# EAGLE design BabyMainBoard_Samd51_SPI_2.3.1_fram_pro_jun2022 (EAGLE 9.6.2)
VVERSION: v1.5 Jan 2022

## Sheet 1 of 3
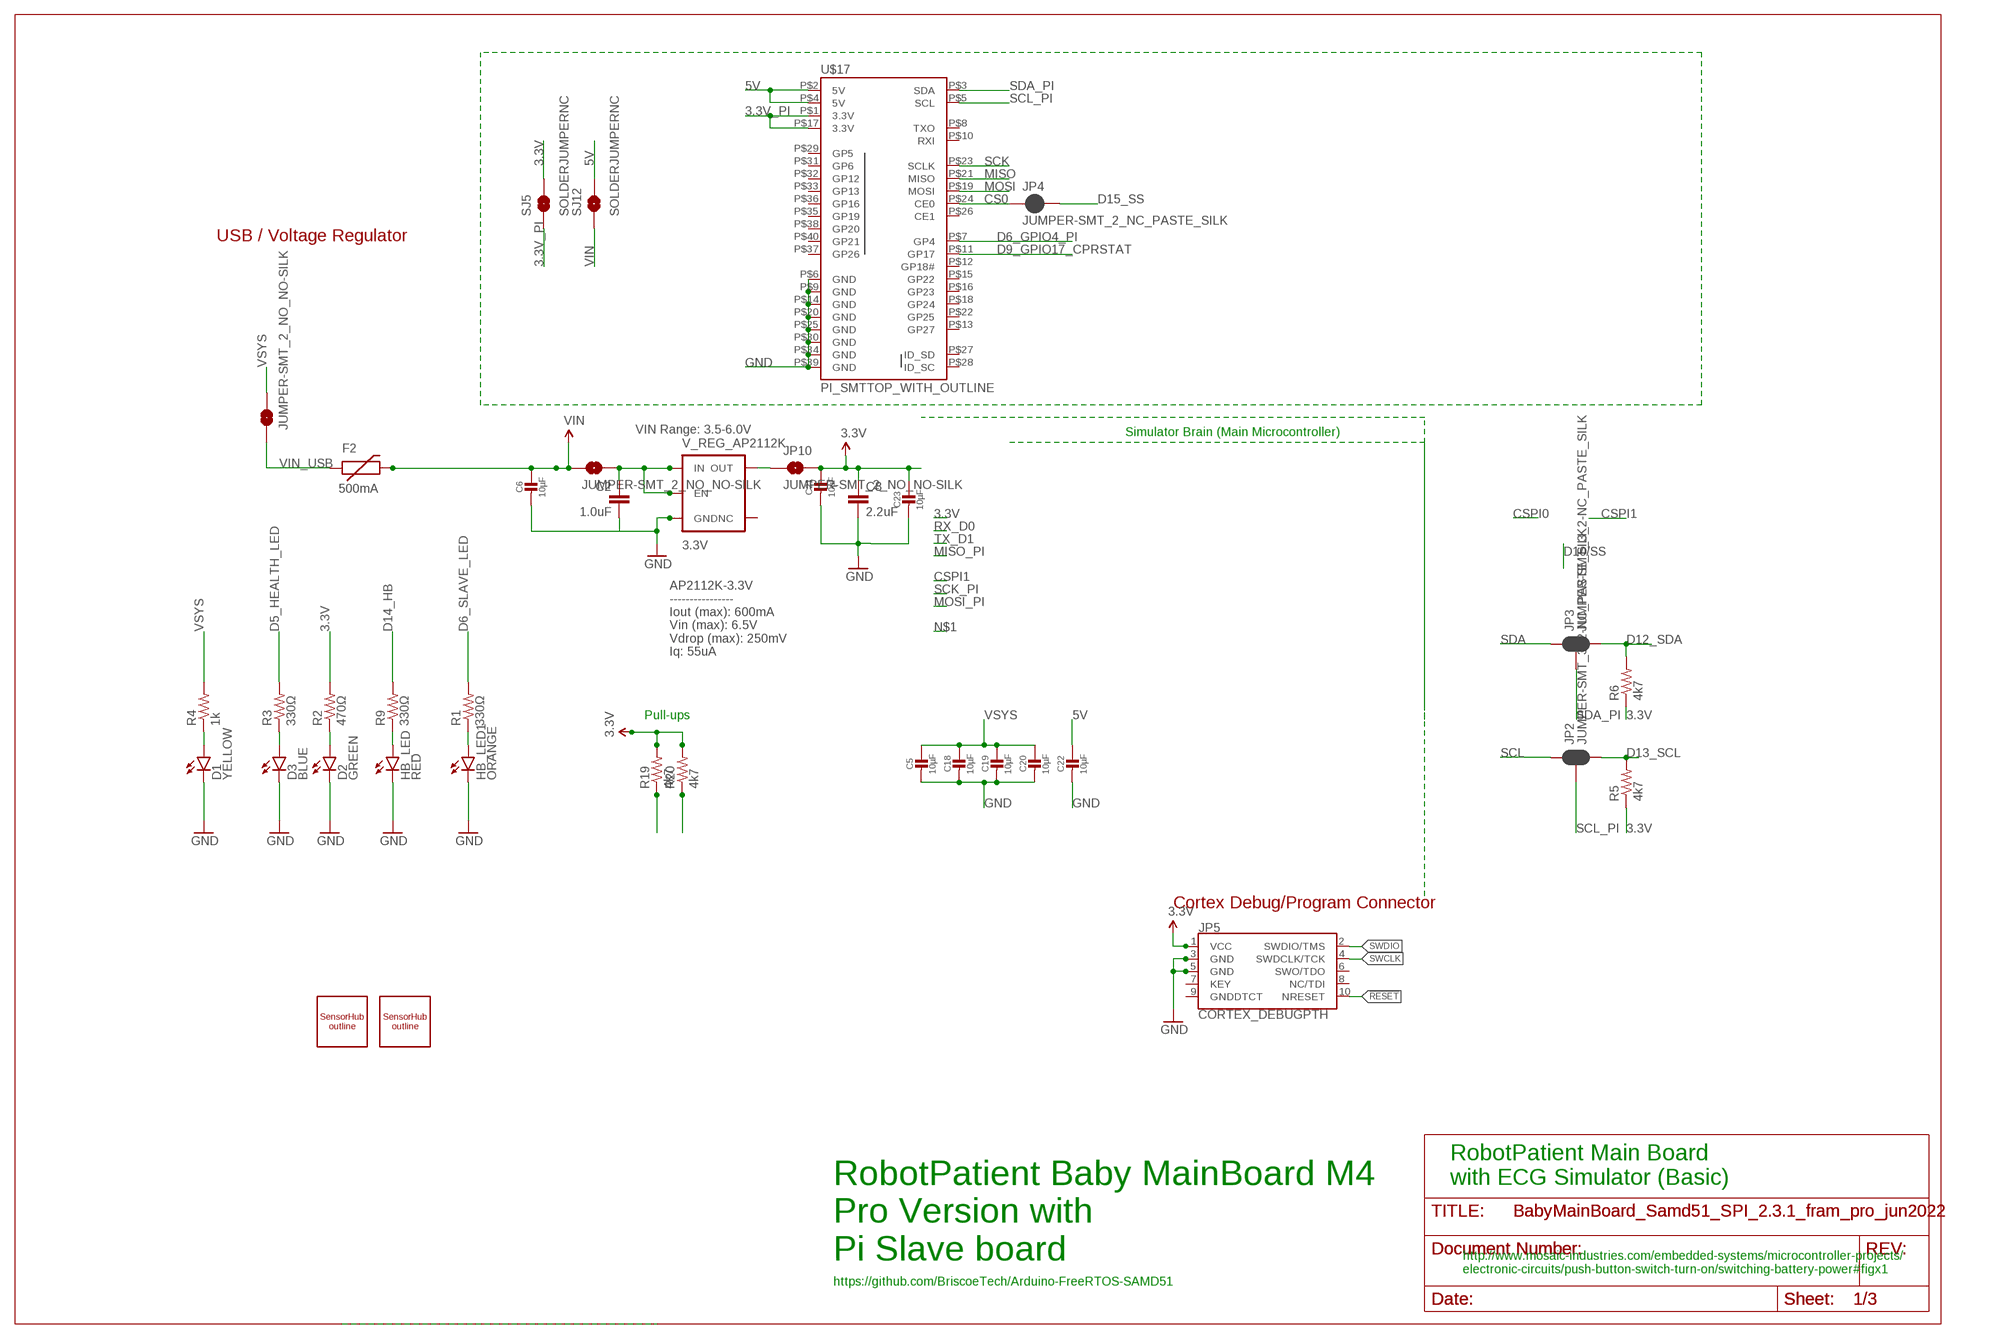
[diagram p0: schematic, sheet 1]

### Parts
C2  1.0uF  1.0UF-25V-+80/-20(0805)"  [0805-CAP]
C5  10µF  CAP_CERAMIC0805  [0805]
C6  10µF  CAP_CERAMIC0805  [0805]
C8  2.2uF  2.2UF-10V-20%(0603)  [0603-CAP]
C18  10µF  CAP_CERAMIC0805  [0805]
C19  10µF  CAP_CERAMIC0805  [0805]
C20  10µF  CAP_CERAMIC0805  [0805]
C21  10µF  CAP_CERAMIC0805  [0805]
C22  10µF  CAP_CERAMIC0805  [0805]
C23  10µF  CAP_CERAMIC0805  [0805]
D1  YELLOW  LED-RED0603  [LED-0603]
D2  GREEN  LED-RED0603  [LED-0603]
D3  BLUE  LED-BLUE0603  [LED-0603]
F2  500mA  PTCSMD  [PTC-1206]
HB_LED  RED  LED-RED0603  [LED-0603]
HB_LED1  ORANGE  LED-RED0603  [LED-0603]
JP1  JUMPER-SMT_2_NO_NO-SILK  [SMT-JUMPER_2_NO_NO-SILK]
JP2  JUMPER-SMT_3_2-NC_PASTE_SILK  [SMT-JUMPER_3_2-NC_PASTE_SILK]
JP3  JUMPER-SMT_3_2-NC_PASTE_SILK  [SMT-JUMPER_3_2-NC_PASTE_SILK]
JP4  JUMPER-SMT_2_NC_PASTE_SILK  [SMT-JUMPER_2_NC_PASTE_SILK]
JP5  CORTEX_DEBUGPTH  [2X5-PTH-1.27MM]
JP10  JUMPER-SMT_2_NO_NO-SILK  [SMT-JUMPER_2_NO_NO-SILK]
JP11  JUMPER-SMT_2_NO_NO-SILK  [SMT-JUMPER_2_NO_NO-SILK]
R1  330Ω  330OHM1/10W1%(0603)  [0603-RES]
R2  470Ω  330OHM1/10W1%(0603)  [0603-RES]
R3  330Ω  330OHM1/10W1%(0603)  [0603-RES]
R4  1k  330OHM1/10W1%(0603)  [0603-RES]
R5  4k7  RESISTOR0603-RES  [0603-RES]
R6  4k7  RESISTOR0603-RES  [0603-RES]
R9  330Ω  330OHM1/10W1%(0603)  [0603-RES]
R19  4k7  47KOHM1/10W1%(0603)  [0603-RES]
R20  4k7  47KOHM1/10W1%(0603)  [0603-RES]
SJ5  SOLDERJUMPERNC  [SJ_2S]
SJ12  SOLDERJUMPERNC  [SJ_2S]
U$15  SENSORHUB_PROFILEOUTLINE  [SENSORHUB_HOLES]
U$16  SENSORHUB_PROFILEOUTLINE  [SENSORHUB_HOLES]
U$17  PI_SMTTOP_WITH_OUTLINE  [PI_SMT_ZERO]
V_REG_AP2112K  3.3V  V_REG_AP2112K-3.3V  [SOT23-5]

### Nets
3.3V [power]: C8.1 C21.1 C23.1 JP5.1(VCC) JP10.2 R2.2 R5.1 R6.1 R19.2 R20.2 SJ5.2 ; also sheet 2,3
3.3V_IN [power]: C2.1 JP11.2 V_REG_AP2112K.1(IN) V_REG_AP2112K.3(EN)
3.3V_PI [power]: SJ5.1 U$17.P$1(3.3V) U$17.P$17(3.3V)
3V3_LED: D2.A R2.1
5V [power]: C22.1 SJ12.2 U$17.P$2(5V) U$17.P$4(5V) ; also sheet 3
5V_LED: D1.A R4.1
!RESET: JP5.10(NRESET) ; also sheet 2
CS0: JP4.1 U$17.P$24(CE0)
D5_HEALTH_LED: D3.A R3.1 R3.2 ; also sheet 2
D6_GPIO4_PI: U$17.P$7(GP4)
D6_SLAVE_LED: R1.2 ; also sheet 2
D6_SLAVE_LED1: HB_LED1.A R1.1
D9_GPIO17_CPRSTAT: U$17.P$11(GP17) ; also sheet 2
D12_SDA: JP3.3 R6.2 ; also sheet 2
D13_SCL: JP2.3 R5.2 ; also sheet 2
D14_HB: R9.2 ; also sheet 2
D14_HB_LED: HB_LED.A R9.1
D15_SS: JP4.2 ; also sheet 2
GND [gnd]: C2.2 C5.2 C6.2 C8.2 C18.2 C19.2 C20.2 C21.2 C22.2 C23.2 D1.C D2.C D3.C HB_LED1.C HB_LED.C JP5.3(GND) JP5.5(GND) U$17.P$6(GND) U$17.P$9(GND) U$17.P$14(GND) U$17.P$20(GND) U$17.P$25(GND) U$17.P$30(GND) U$17.P$34(GND) U$17.P$39(GND) V_REG_AP2112K.2(GND) ; also sheet 2,3
MISO: U$17.P$21(MISO) ; also sheet 2
MOSI: U$17.P$19(MOSI) ; also sheet 2
N$9: JP10.1 V_REG_AP2112K.5(OUT)
SCK: U$17.P$23(SCLK) ; also sheet 2
SCL: JP2.1 R19.1 ; also sheet 2,3
SCL_PI: JP2.2 U$17.P$5(SCL)
SDA: JP3.1 R20.1 ; also sheet 2,3
SDA_PI: JP3.2 U$17.P$3(SDA)
SWCLK: JP5.4(SWDCLK/TCK) ; also sheet 2
SWDIO: JP5.2(SWDIO/TMS) ; also sheet 2
VIN [power]: C6.1 F2.2 JP11.1 SJ12.1
VIN_USB [power]: F2.1 JP1.1 ; also sheet 2
VSYS [power]: C5.1 C18.1 C19.1 C20.1 JP1.2 R4.2 ; also sheet 3
Unconnected: JP5.6(SWO/TDO) JP5.7(KEY) JP5.8(NC/TDI) JP5.9(GNDDTCT) U$17.P$8(TXO) U$17.P$10(RXI) U$17.P$12(GP18#) U$17.P$13(GP27) U$17.P$15(GP22) U$17.P$16(GP23) U$17.P$18(GP24) U$17.P$22(GP25) U$17.P$26(CE1) U$17.P$27(ID_SD) U$17.P$28(ID_SC) U$17.P$29(GP5) U$17.P$31(GP6) U$17.P$32(GP12) U$17.P$33(GP13) U$17.P$35(GP19) U$17.P$36(GP16) U$17.P$37(GP26) U$17.P$38(GP20) U$17.P$40(GP21) V_REG_AP2112K.4(NC)

### Notes on the sheet
- USB / Voltage Regulator
- VIN Range: 3.5-6.0V
- Simulator Brain (Main Microcontroller)
- AP2112K-3.3V
  ----------------
  Iout (max): 600mA 
  Vin (max): 6.5V
  Vdrop (max): 250mV
  Iq: 55uA
- Pull-ups
- Cortex Debug/Program Connector
- RobotPatient Main Board
  with ECG Simulator (Basic)
- RobotPatient Baby MainBoard M4
  Pro Version with 
  Pi Slave board
- http://www.mosaic-industries.com/embedded-systems/microcontroller-projects/
  electronic-circuits/push-button-switch-turn-on/switching-battery-power#figx1
- https://github.com/BriscoeTech/Arduino-FreeRTOS-SAMD51

## Sheet 2 of 3
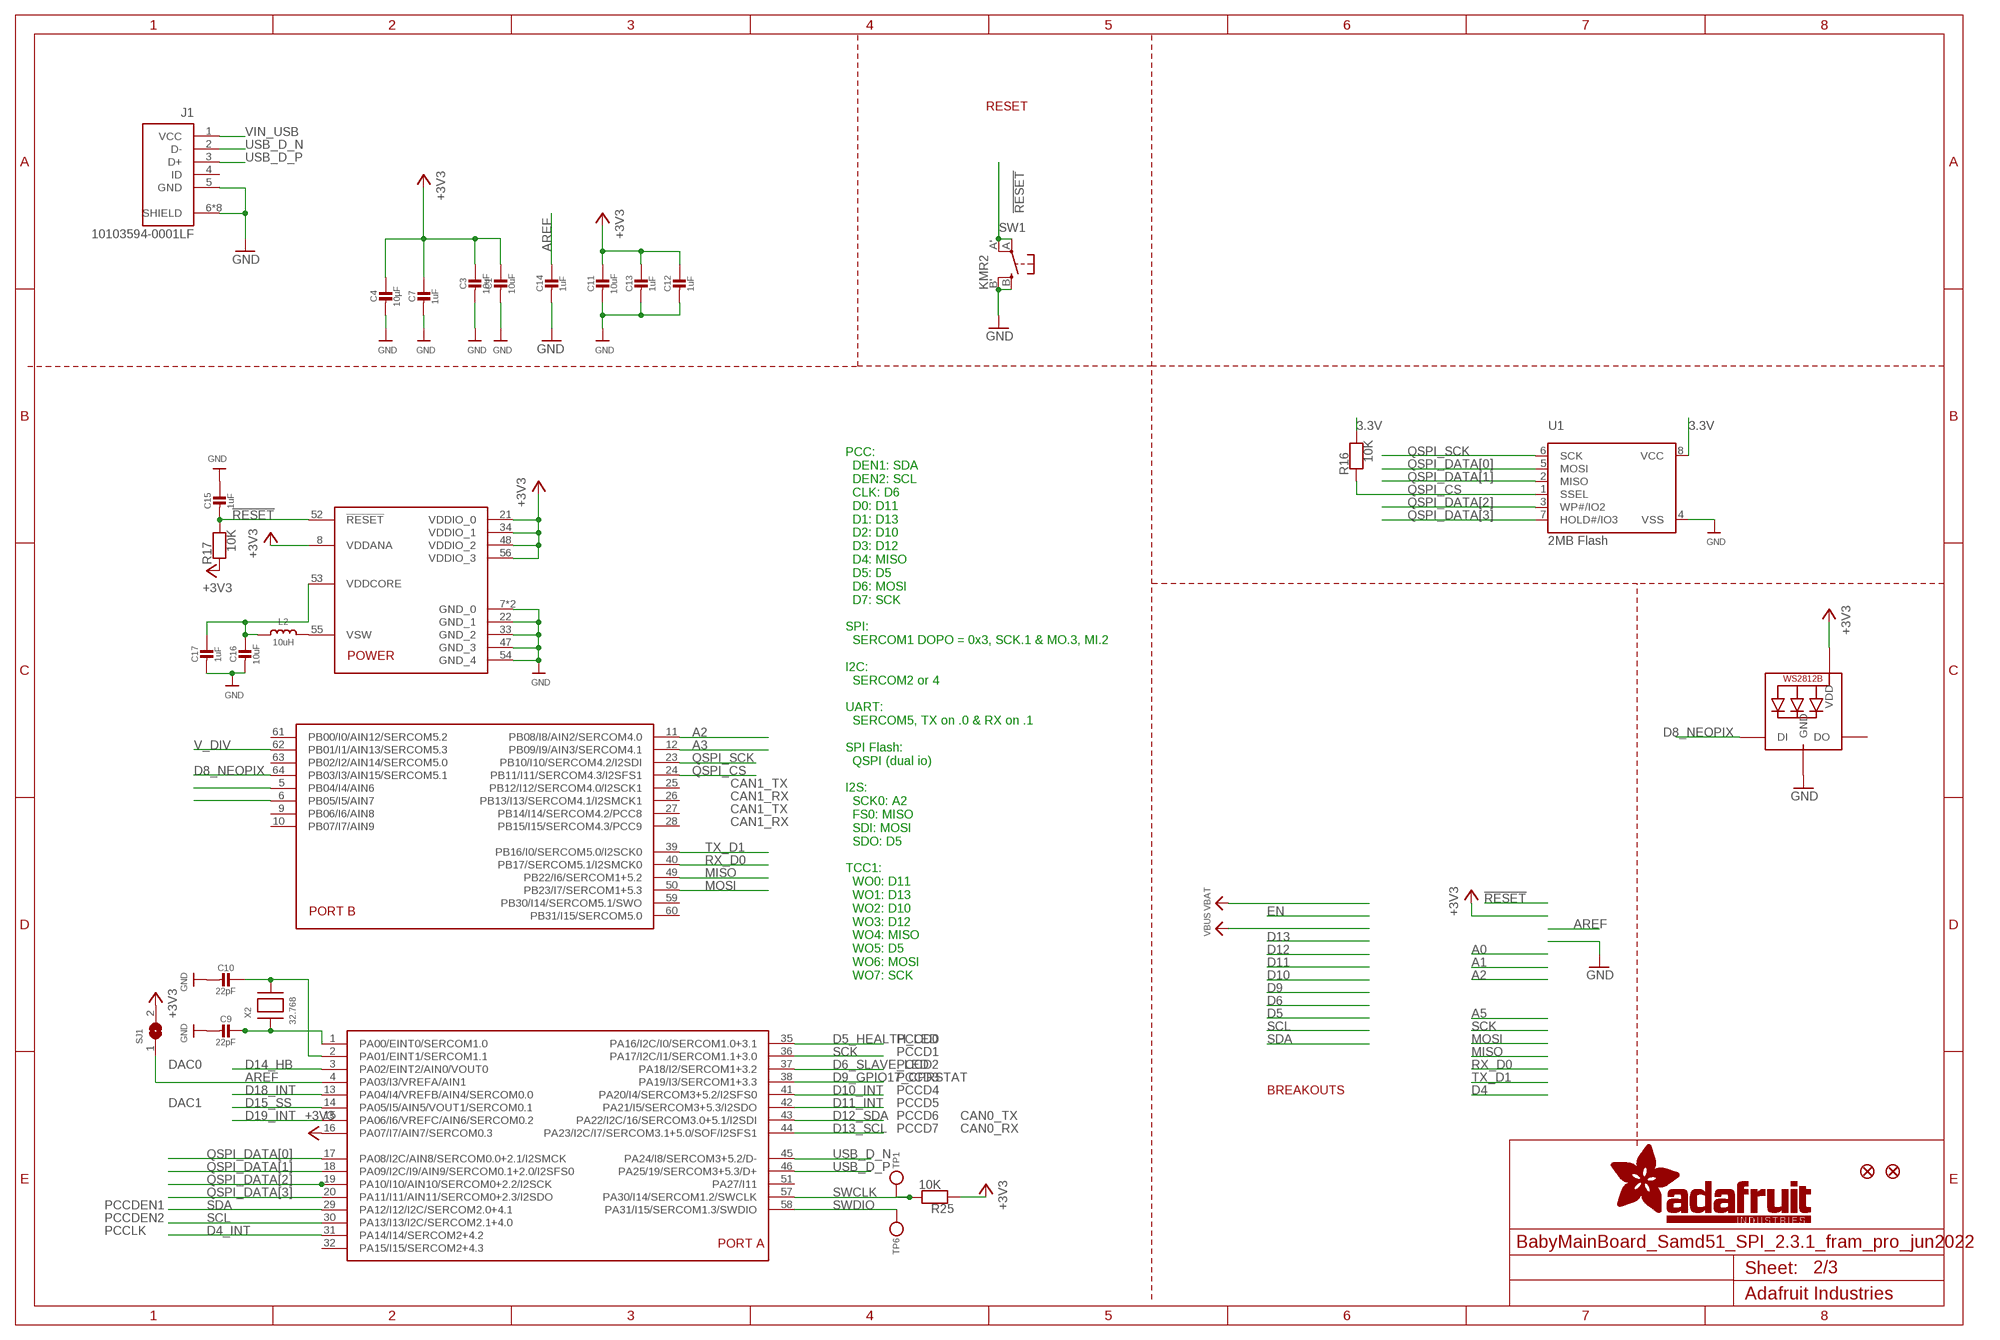
[diagram p1: schematic, sheet 2]

### Parts
C1  10uF  CAP_CERAMIC0805  [0805]
C3  10uF  CAP_CERAMIC0805  [0805]
C4  10µF  CAP_CERAMIC0805  [0805]
C7  1uF  CAP_CERAMIC0603  [0603]
C9  22pF  CAP_CERAMIC0603  [0603]
C10  22pF  CAP_CERAMIC0603  [0603]
C11  10uF  CAP_CERAMIC0805  [0805]
C12  1uF  CAP_CERAMIC0603  [0603]
C13  1uF  CAP_CERAMIC0603  [0603]
C14  1uF  CAP_CERAMIC0603  [0603]
C15  1uF  CAP_CERAMIC0603  [0603]
C16  10uF  CAP_CERAMIC0805  [0805]
C17  1uF  CAP_CERAMIC0603  [0603]
J1  10103594-0001LF  [AMPHENOL_10103594-0001LF]
L2  10uH  INDUCTOR  [INDUCTOR_1007]
LED3  WS2812B3535  [LED3535]
R16  10K  RESISTOR0603  [0603]
R17  10K  RESISTOR0603  [0603]
R25  10K  RESISTOR0603  [0603]
SJ1  SOLDERJUMPERCLOSED  [SOLDERJUMPER_CLOSEDWIRE]
SW1  KMR2  SWITCH_TACT_SMT4.6X2.8  [BTN_KMR2_4.6X2.8]
TP1  TESTPOINTROUND1MM  [TESTPOINT_ROUND_1MM]
TP6  TESTPOINTROUND1MM  [TESTPOINT_ROUND_1MM]
U1  2MB Flash  SPIFLASH_8PINUX  [USON8]
U$14  ATSAMD51J  [PQFN64-1]
U$34  FIDUCIAL""  [FIDUCIAL_1MM]
U$35  FIDUCIAL""  [FIDUCIAL_1MM]
X2  32.768  XTAL-3.2X1.5  [XTAL3215]

### Nets
3.3V [power]: C1.1 C3.1 C4.1 C7.1 C11.1 C12.1 C13.1 LED3.2(VDD) R16.2 R17.1 R25.1 SJ1.2 U1.8(VCC) U$14.8(VDDANA) U$14.16(PA07/I7/AIN7/SERCOM0.3) U$14.21(VDDIO_0) U$14.34(VDDIO_1) U$14.48(VDDIO_2) U$14.56(VDDIO_3) ; supply symbol labelled +3V3 ; also sheet 1,3
!RESET: C15.2 R17.2 SW1.A'(P1) SW1.A(P) U$14.52(!RESET) ; also sheet 1
A2: U$14.11(PB08/I8/AIN2/SERCOM4.0)
A3: U$14.12(PB09/I9/AIN3/SERCOM4.1)
AREF: C14.1 SJ1.1 U$14.4(PA03/I3/VREFA/AIN1)
D4_INT: U$14.31(PA14/I14/SERCOM2+4.2) ; also sheet 3
D5_HEALTH_LED: U$14.35(PA16/I2C/I0/SERCOM1.0+3.1) ; also sheet 1
D6_SLAVE_LED: U$14.37(PA18/I2/SERCOM1+3.2) ; also sheet 1
D8_NEOPIX: LED3.1(DI) U$14.64(PB03/I3/AIN15/SERCOM5.1)
D9_GPIO17_CPRSTAT: U$14.38(PA19/I3/SERCOM1+3.3) ; also sheet 1
D10_INT: U$14.41(PA20/I4/SERCOM3+5.2/I2SFS0) ; also sheet 3
D11_INT: U$14.42(PA21/I5/SERCOM3+5.3/I2SDO) ; also sheet 3
D12_SDA: U$14.43(PA22/I2C/16/SERCOM3.0+5.1/I2SDI) ; also sheet 1
D13_SCL: U$14.44(PA23/I2C/I7/SERCOM3.1+5.0/SOF/I2SFS1) ; also sheet 1
D14_HB: U$14.3(PA02/EINT2/AIN0/VOUT0) ; also sheet 1
D15_SS: U$14.14(PA05/I5/AIN5/VOUT1/SERCOM0.1) ; also sheet 1
D18_INT: U$14.13(PA04/I4/VREFB/AIN4/SERCOM0.0) ; also sheet 3
D19_INT: U$14.15(PA06/I6/VREFC/AIN6/SERCOM0.2) ; also sheet 3
GND [gnd]: C1.2 C3.2 C4.2 C7.2 C9.2 C10.2 C11.2 C12.2 C13.2 C14.2 C15.1 C16.2 C17.2 J1.5(GND) J1.6(SHIELD) J1.7(SHIELD) J1.8(SHIELD) J1.9(SHIELD) J1.10(SHIELD) J1.11(SHIELD) J1.S1(SHIELD) J1.S2(SHIELD) LED3.4(GND) SW1.B'(S1) SW1.B(S) U1.4(VSS) U$14.7(GND_0) U$14.22(GND_1) U$14.33(GND_2) U$14.47(GND_3) U$14.54(GND_4) U$14.EXP(GND_0) ; also sheet 1,3
MISO: U$14.49(PB22/I6/SERCOM1+5.2) ; also sheet 1
MOSI: U$14.50(PB23/I7/SERCOM1+5.3) ; also sheet 1
N$2: U$14.5(PB04/I4/AIN6)
N$3: U$14.6(PB05/I5/AIN7)
N$16: C9.1 U$14.1(PA00/EINT0/SERCOM1.0) X2.P$1
N$17: C10.1 U$14.2(PA01/EINT1/SERCOM1.1) X2.P$2
N$18: L2.P$2 U$14.55(VSW)
QSPI_CS: R16.1 U1.1(SSEL) U$14.24(PB11/I11/SERCOM4.3/I2SFS1)
QSPI_DATA[0]: U1.5(MOSI) U$14.17(PA08/I2C/AIN8/SERCOM0.0+2.1/I2SMCK)
QSPI_DATA[1]: U1.2(MISO) U$14.18(PA09/I2C/I9/AIN9/SERCOM0.1+2.0/I2SFS0)
QSPI_DATA[2]: U1.3(WP#/IO2) U$14.19(PA10/I10/AIN10/SERCOM0+2.2/I2SCK)
QSPI_DATA[3]: U1.7(HOLD#/IO3) U$14.20(PA11/I11/AIN11/SERCOM0+2.3/I2SDO)
QSPI_SCK: U1.6(SCK) U$14.23(PB10/I10/SERCOM4.2/I2SDI)
RX_D0: U$14.40(PB17/SERCOM5.1/I2SMCK0) ; also sheet 1,3
SCK: U$14.36(PA17/I2C/I1/SERCOM1.1+3.0) ; also sheet 1
SCL: U$14.30(PA13/I13/I2C/SERCOM2.1+4.0) ; also sheet 1,3
SDA: U$14.29(PA12/I12/I2C/SERCOM2.0+4.1) ; also sheet 1,3
SWCLK: R25.2 TP1.P$1 U$14.57(PA30/I14/SERCOM1.2/SWCLK) ; also sheet 1
SWDIO: TP6.P$1 U$14.58(PA31/I15/SERCOM1.3/SWDIO) ; also sheet 1
TX_D1: U$14.39(PB16/I0/SERCOM5.0/I2SCK0) ; also sheet 1,3
USB_D_N [usb]: J1.2(D-) U$14.45(PA24/I8/SERCOM3+5.2/D-)
USB_D_P [usb]: J1.3(D+) U$14.46(PA25/19/SERCOM3+5.3/D+)
V_DIV: U$14.62(PB01/I1/AIN13/SERCOM5.3)
VDDCORE1: C16.1 C17.1 L2.P$1 U$14.53(VDDCORE)
VIN_USB [power]: J1.1(VCC) ; also sheet 1
Unconnected: J1.4(ID) LED3.3(DO) U$14.9(PB06/I6/AIN8) U$14.10(PB07/I7/AIN9) U$14.25(PB12/I12/SERCOM4.0/I2SCK1) U$14.26(PB13/I13/SERCOM4.1/I2SMCK1) U$14.27(PB14/I14/SERCOM4.2/PCC8) U$14.28(PB15/I15/SERCOM4.3/PCC9) U$14.32(PA15/I15/SERCOM2+4.3) U$14.51(PA27/I11) U$14.59(PB30/I14/SERCOM5.1/SWO) U$14.60(PB31/I15/SERCOM5.0) U$14.61(PB00/I0/AIN12/SERCOM5.2) U$14.63(PB02/I2/AIN14/SERCOM5.0)

### Notes on the sheet
- RESET
- CAN1_TX
- CAN1_RX
- CAN1_TX
- CAN1_RX
- PCC:
    DEN1: SDA
    DEN2: SCL
    CLK: D6
    D0: D11
    D1: D13
    D2: D10
    D3: D12
    D4: MISO
    D5: D5
    D6: MOSI
    D7: SCK
  
  SPI:
    SERCOM1 DOPO = 0x3, SCK.1 & MO.3, MI.2
  
  I2C:
    SERCOM2 or 4
  
  UART:
    SERCOM5, TX on .0 & RX on .1
  
  SPI Flash:
    QSPI (dual io)
  
  I2S:
    SCK0: A2
    FS0: MISO
    SDI: MOSI
    SDO: D5
  
  TCC1:
    WO0: D11
    WO1: D13
    WO2: D10
    WO3: D12
    WO4: MISO
    WO5: D5
    WO6: MOSI
    WO7: SCK
- PCCD0
- PCCD1
- DAC0 | PCCD2
- PCCD3
- PCCD4 | BREAKOUTS
- DAC1 | PCCD5
- PCCD6 | CAN0_TX
- PCCD7 | CAN0_RX
- PCCDEN1
- PCCDEN2
- PCCLK

## Sheet 3 of 3
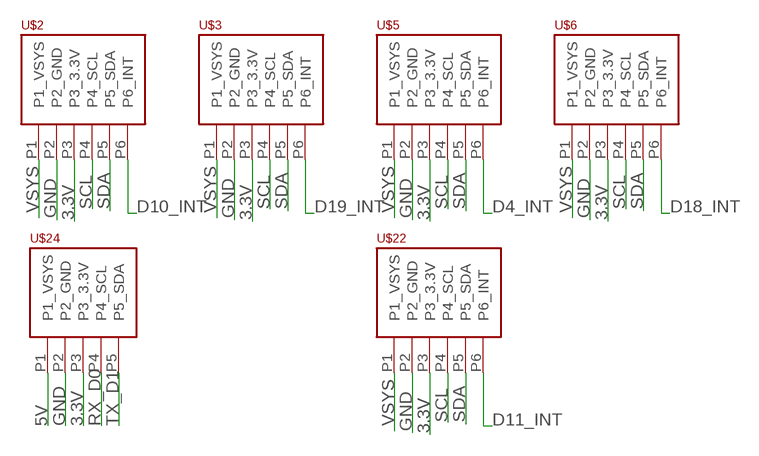
[diagram p2: schematic, sheet 3]

### Parts
U$2  PHOENIX_PTSM_M6_TH_I2CPPANGLE  [PTSM_M6_THRHOLE]
U$3  PHOENIX_PTSM_M6_TH_I2CPPANGLE  [PTSM_M6_THRHOLE]
U$5  PHOENIX_PTSM_M6_TH_I2CPPANGLE  [PTSM_M6_THRHOLE]
U$6  PHOENIX_PTSM_M6_TH_I2CPPSTRAIGHT  [PTSM_M6_TH_UP_NEUTRAL]
U$22  PHOENIX_PTSM_M6_TH_I2CPPANGLE  [PTSM_M6_THRHOLE]
U$24  PHOENIX_PTSM_M5_THUART  [PTSM_M5_TH_UART]

### Nets
3.3V [power]: U$2.P3(P3_3.3V) U$3.P3(P3_3.3V) U$5.P3(P3_3.3V) U$6.P3(P3_3.3V) U$22.P3(P3_3.3V) U$24.P3(P3_3.3V) ; also sheet 1,2
5V [power]: U$24.P1(P1_VSYS) ; also sheet 1
D4_INT: U$5.P6(P6_INT) ; also sheet 2
D10_INT: U$2.P6(P6_INT) ; also sheet 2
D11_INT: U$22.P6(P6_INT) ; also sheet 2
D18_INT: U$6.P6(P6_INT) ; also sheet 2
D19_INT: U$3.P6(P6_INT) ; also sheet 2
GND [gnd]: U$2.P2(P2_GND) U$3.P2(P2_GND) U$5.P2(P2_GND) U$6.P2(P2_GND) U$22.P2(P2_GND) U$24.P2(P2_GND) ; also sheet 1,2
RX_D0: U$24.P4(P4_SCL) ; also sheet 1,2
SCL: U$2.P4(P4_SCL) U$3.P4(P4_SCL) U$5.P4(P4_SCL) U$6.P4(P4_SCL) U$22.P4(P4_SCL) ; also sheet 1,2
SDA: U$2.P5(P5_SDA) U$3.P5(P5_SDA) U$5.P5(P5_SDA) U$6.P5(P5_SDA) U$22.P5(P5_SDA) ; also sheet 1,2
TX_D1: U$24.P5(P5_SDA) ; also sheet 1,2
VSYS [power]: U$2.P1(P1_VSYS) U$3.P1(P1_VSYS) U$5.P1(P1_VSYS) U$6.P1(P1_VSYS) U$22.P1(P1_VSYS) ; also sheet 1

## Library data of the parts
C1 C3-C7 C9-C23 = microbuilder:CAP_CERAMIC: Ceramic Capacitors 0402 - 0402 Surface Mount Capacitors 16pF 50V 5% [Digikey: 445-4899-2-ND] 18pF 50V 5% [Digikey: 490-1281-2-ND] 22pF 50V 5% [Digikey: 490-1283-2-ND] 68pF 50V 5% [Digikey: 490-1289-2-ND] 0.1uF 10V 10% [Digikey: 490-1318-2-ND] 1.0uF 6.3V 10% [Digikey: 490-1320-2-ND] 0603 - 0603 Surface Mount Capacitors 16 pF 50V 5% [Digikey: 445-5051-2-ND] 22 pF 50V [Digikey: PCC220ACVTR-ND] 33 pF 50V 5% [Digikey: 490-1415-1-ND] 56pF 50V 5% [Digikey: 490-1421-1-ND] 220pF 50V 5% [Digikey: 445-1285-1-ND] 680 pF 50V 2200 pF 50V 5% C0G [Digikey: 445-1297-1-ND] 5600 pF 100V 5% X7R [Digikey: 478-3711-1-ND] 0.1 µF 25V 10% [Digikey: PCC2277TR-ND] 0.22 µF 16V 10% X7R [Digikey: 445-1318-1-ND] 1.0 µF 25V 10% [Digikey: 445-5146-2-ND] 0603 - RF Specific 3pF 250V +/-0.1pF RF [Digikey: 712-1347-1-ND] 18 pF 250V 5% [Digikey: 478-3505-1-ND or 712-1322-1-ND] 56 pF 250V 5% C0G RF [Digikey: 490-4867-1-ND] 68 pF 250V RF [Digikey: 490-4868-1-ND] 0805 - 0805 Surface Mount Capacitors 220 pF 250V 2% RF Ceramic Capacitor [Digikey: 712-1398-1-ND] 1000 pF 50V 2% NP0 Ceramic Capacitor [Digikey: 478-3760-1-ND] 0.1 µF 25V 10% Ceramic Capacitor [Digikey: PCC1828TR-ND] 1.0 µF 16V 10% Ceramic Capacitor[Digikey: 490-1691-2-ND] 10.0 µF 10V 10% Ceramic Capacitor[Digikey: 709-1228-1-ND] 10.0 uF 16V 10% Ceramic Capacitor [Digikey: 478-5165-2-ND] 47 uF 6.3V 20% Ceramic Capacitor [Digikey: 587-1779-1-ND or 399-5506-1-ND] 1206 - 1206 Surface Mount Capacitors 47uF 10V 20% Ceramic Capacitor [Digikey: 490-5528-1-ND or 399-5508-1-ND or 445-6010-1-ND] 100uF 6.3V -20%, +80% Y5V Ceramic Capacitor (Digikey: 490-4512-1-ND, Mouser: 81-GRM31CF50J107ZE1L)
C2 = SparkFun-Capacitors:1.0UF-25V-+80/-20(0805): CAP-11625; PROD_ID: CAP-11625
C8 = SparkFun-Capacitors:2.2UF-10V-20%(0603): CAP-07888; PROD_ID: CAP-07888
D1 D2 HB_LED1 = SparkFun-LED:LED-RED: Assorted Red LEDs LilyPad 1206- DIO-09912 1206- DIO-00809 0603- DIO-00819 "SMART" means more efficient and expensive; PROD_ID: DIO-00819; VALUE: RED
D3 = SparkFun-LED:LED-BLUE: Blue LEDs for production use Various blue LEDs stocked by SparkFun production 0603 - DIO-08575 Rebel - DIO-09553 1206 - DIO-09911; PROD_ID: DIO-08575
F2 = SparkFun-PowerIC:PTC: Resettable Fuse PTC Resettable Fuse. Spark Fun Electronics SKU : COM-08357; PROD_ID: RES-11150
HB_LED = SparkFun-LED:LED-RED: Assorted Red LEDs LilyPad 1206- DIO-09912 1206- DIO-00809 0603- DIO-00819 "SMART" means more efficient and expensive; PROD_ID: DIO-00819
J1 = 10103594-0001LF:10103594-0001LF: USB - micro B USB 2.0 Receptacle Connector 5 Position Surface Mount, Right Angle; Through Hole Check availability <https://pricing.snapeda.com/parts/10103594-0001LF/AMPHENOL%20ICC%20/%20FCI/view-part?ref=eda>; AVAILABILITY: In Stock; DESCRIPTION: Micro USB 2.0, Input Output Connectors, B TYPE RECEPTACLE; MF: AMPHENOL ICC / FCI; MP: 10103594-0001LF; PACKAGE: None; PRICE: None; PURCHASE-URL: https://pricing.snapeda.com/search/part/10103594-0001LF/?ref=eda
JP1 JP10 JP11 = SparkFun-Jumpers:JUMPER-SMT_2_NO: Normally open jumper This jumper has two pads in close proximity to each other. Apply solder to close the connection. Round pads are easier to solder for beginners, but are a lot larger. SparkFun Product that uses the round pads: SparkFun EL Sequencer <https://www.sparkfun.com/products/12781>
JP2 JP3 = SparkFun-Jumpers:JUMPER-SMT_3_2-NC_PASTE: Normally closed solder jumper (2 of 2 connections) This jumper has an aperture in the stencil to allow solder paste to bridge both connections. Both connections are normally closed (NC). Wick off the solder to open the connection(s). Reapply solder to reclose the connection(s).
JP4 = SparkFun-Jumpers:JUMPER-SMT_2_NC_PASTE: Normally closed solder jumper This jumper has an aperture in the stencil to allow solder paste to bridge the split in the wire so it's normally closed (NC). Wick off the solder to open the connection. Reapply solder to reclose the connection.
JP5 = samd21-temp:CORTEX_DEBUG: Cortex Debug Connector Datasheet <http://infocenter.arm.com/help/topic/com.arm.doc.faqs/attached/13634/cortex_debug_connectors.pdf>
L2 = microbuilder:INDUCTOR: Inductors 0603: 10nH Ceramic Inductor - microwire antenna/RF (Digikey: 712-1434-2-ND) 0805: 560nH Ceramic Inductor - RF (Digikey: 553-1047-1-ND) 270nH Ceramic Inductor - Q = 40@250MHz, +-5%, 1 Ohm DC Resistance (Digikey: 535-10506-2-ND) 1007 (2518 Metric) SMT: 10µH 10% 250mOhm 820mA 1007 Inductor (Digikey: 587-2189-1-ND) 22µH 10% 500mOhm 580mA 1007 Inductor (Digikey: 587-2190-1-ND) 47µH 10% 950mOhm 420mA 1007 Inductor (Digikey: 587-2191-1-ND) 47µH 5% 100mOhm 1A 1008 Inductor (Digikey: 732-1816-1-ND) 5.0x5.0mm (Taiyo Yuden NR5040 Series) 6.8µH 20% 2.3A 64mOhm Inductor (Digikey: 587-2374-2-ND) 5.0x5.0mm (TDK VLC5045 Series) 4.7µH 20% 3.3A 34mOhm Inductor (Digikey: 445-6526-1-ND) 6.8µH 20% 2.7A 46mOhm Inductor (Digikey: 445-6527-1-ND) 6.0x6.0mm (TDK VLC6045 Series) 4.7µH 20% 3.8A 27mOhm Inductor (Digikey: 445-6538-2-ND) 6.8µH 20% 3A 41mOhm Inductor (Digikey: 445-6540-1-ND) 6.2µH 30% 2.2A 45mOhm Inductor (Digikey: SRR5028-6R2YCT-ND) - Not TDK VLC6045 but footprint should match 6.0x6.0mm (TDK SLF6045 Series) 6.8uH 30% 2A 33mOhm Inductor (Digikey: 445-4572-1-ND, Mouser: 810-SLF645T6R8N2R0PF)
LED3 = microbuilder:WS2812B
R1-R4 R9 = SparkFun-Resistors:330OHM1/10W1%(0603): RES-00818; PROD_ID: RES-00818; VALUE: 330
R5 R6 = SparkFun-Passives:RESISTOR: Resistor Basic schematic elements and footprints for 0603, 1206, and PTH resistors.
R16 R17 R25 = microbuilder:RESISTOR: Resistors 0402 - 0402 Surface Mount Package 22 Ohm 1% 1/16W [Digikey: 311-22.0LRTR-ND] 33 Ohm 5% 1/16W 1.0K 5% 1/16W 1.5K 5% 1/16W 2.0K 1% 1/16W 10.0K 1% 1/16W [Digikey: 311-10.0KLRTR-ND] 10.0K 5% 1/16W [Digikey: RMCF0402JT10K0TR-ND] 12.1K 1% 1/16W [Digikey: 311-22.0LRTR-ND] 100.0K 5% 1/16W 0603 - 0603 Surface Mount Package 0 Ohm 1/10 Watt 1% Resistor 15 Ohm 1/10 Watt 1% Resistor 33 Ohm 1/10 Watt 1% Resistor 49.9 Ohm 1/10 Watt 1% Resistor 100 Ohm 1/10 Watt 1% Resistor 150 Ohm 1/10 Watt 1% Resistor 240 Ohm 1/10 Watt 1% Resistor 390 Ohm 1/10 Watt 1% Resistor 560 Ohm 1/10 Watt 1% Resistor 680 Ohm 1/10 Watt 1% Resistor 750 Ohm 1/10 Watt 1% Resistor 1.0K Ohm 1/10 Watt 1% Resistor 1.5K Ohm 1/10 Watt 1% Resistor 2.0K Ohm 1/10 Watt 1% Resistor 2.2K Ohm 1/10 Watt 1% Resistor 3.3K Ohm 1/10 Watt 1% Resistor 4.7K Ohm 1/10 Watt 1% Resistor 10.0K Ohm 1/10 Watt 1% Resistor 12.0K Ohm 1/10 Watt 1% Resistor 12.1K Ohm 1/10 Watt 1% Resistor 20.0K Ohm 1/10 Watt 1% Resistor 33.0K Ohm 1/10 Watt 1% Resistor 100.0K Ohm 1/10 Watt 1% Resistor 0805 - 0805 Surface Mount Package 0 Ohm 1/8 Watt 1% Resistor 33 Ohm 1/8 Watt 1% Resistor 100 Ohm 1/8 Watt 1% Resistor 150 Ohm 1/8 Watt 1% Resistor 200 Ohm 1/8 Watt 1% Resistor 240 Ohm 1/8 Watt 1% Resistor 330 Ohm 1/8 Watt 1% Resistor 390 Ohm 1/8 Watt 1% Resistor 470 Ohm 1/8 Watt 1% Resistor 1.0K Ohm 1/8 Watt 1% Resistor 1.5K Ohm 1/8 Watt 1% Resistor 2.0K Ohm 1/8 Watt 1% Resistor 4.7K Ohm 1/8 Watt 1% Resistor 5.1K Ohm 1/8 Watt 1% Resistor 5.6K Ohm 1/8 Watt 1% Resistor 10.0K Ohm 1/8 Watt 1% Resistor 22.0K Ohm 1/8 Watt 1% Resistor 33.0K Ohm 1/8 Watt 1% Resistor 100K Ohm 1/8 Watt 1% Resistor 1206 - 1206 Surface Mount Package 2012 - 2010 Surface Mount Package 0.11 Ohm 1/2 Watt 1% Resistor - Digikey: RHM.11UCT-ND
R19 R20 = SparkFun-Resistors:47KOHM1/10W1%(0603): RES-07871; PROD_ID: RES-07871; VALUE: 47K
SJ1 = microbuilder:SOLDERJUMPER: SMD Solder JUMPER Solder the two pads together to create a connection, or remove the solder to break it. REFLOW - Use this footprint for solder paste and reflow ovens. WAVE - Use this footprint for hand-soldering (larger pads). CLOSED - Has a trace between the two pads to ensure it is closed by default. The trace needs to be cut to disable the jumper, and can be closed again by creating a solder bridge between the two pads.
SJ5 SJ12 = SparkFun:SOLDERJUMPER: Solder Jumper Standard SMD solder jumper. Used to automate production. Two varients : Normally Open and Normally Closed are the same, but have different paste layers. NC will have a large amount of paste and should jumper during reflow.
SW1 = microbuilder:SWITCH_TACT_SMT: SMT Tact Switches 6x6mm - Digikey: P12940SCT-ND KMR2 (4.6x2.8mm) - Digikey: 401-1426-1-ND EVQ-PQHB55 - Light Touch, 160GF (4.5x4.5mm) - Digikey: P8090SCT-ND
TP1 TP6 = microbuilder:TESTPOINT: Test Point Various test points for characterisation and PCB testing TESTPOINT_SMT - Compact Surface Mount Test Point [Digikey: 5016KTR-ND]
U1 = microbuilder:SPIFLASH_8PIN: SOIC8 SPI Flash Be careful with the size since SOIC8 flash comes in several 'widths' SOIC8 150 mil M25P16 - 16Mbit (2Mbit x 8) Serial Flash (75MHz SPI Bus), Supply: 2.7-3.6V Digikey: SOIC8 - M25P16-VMN6P-ND SOIC8 208 mil W25Q16BVSSIG - 16Mbit (2Mbit x 8) Serial Flash (104MHz SPI Bus), Supply: 2.7-3.6V Digikey: SOIC8 - W25Q16BVSSIG-ND
U$2 U$3 U$5 U$6 U$22 = jk_customs:PHOENIX_PTSM_M6_TH_I2CPP
U$14 = microbuilder:ATSAMD51J: ATSAMD51J cortex m4 microcontroller
U$15 U$16 = jk_customs:SENSORHUB_PROFILE
U$17 = jk_customs:PI_SMT
U$24 = jk_customs:PHOENIX_PTSM_M5_TH: Datasheet Phoenix PTSM 0,5/ 5-HH-2,5-THR R32 <https://www.phoenixcontact.com/online/portal/us?uri=pxc-oc-itemdetail:pid=1778654&library=usen&pdfmode=direct&pdflanguage=en>
U$34 U$35 = microbuilder:FIDUCIAL: Fiducial Alignment Points Various fiducial points for machine vision alignment.
V_REG_AP2112K = SparkFun-PowerIC:V_REG_AP2112: AP2112 - 600mA CMOS LDO Regulator w/ Enable The AP2112 is CMOS process low dropout linear regulator with enable function, the regulator delivers a guaranteed 600mA (min.) continuous load current. Features Output Voltage Accuracy: ±1.5% Output Current: 600mA (Min.) Foldback Short Current Protection: 50mA Enable Function to Turn ON/OFF VOUT Low Dropout Voltage (3.3V): 250mV (Typ.) @IOUT=600mA Excellent Load Regulation: 0.2%/A (Typ.) Excellent Line Regulation: 0.02%/V (Typ.) Low Quiescent Current: 55μA (Typ.) Low Standby Current: 0.01μA (Typ.) Low Output Noise: 50μVRMS PSRR: 100Hz -65dB, 1kHz -65dB OTSD Protection Stable with 1.0μF Flexible Cap: Ceramic, Tantalum and Aluminum Electrolytic Operation Temperature Range: -40°C to 85°C ESD: MM 400V, HBM 4000V; PROD_ID: VREG-12457
X2 = adafruit2:XTAL: Low cost SMT crystals, no capacitors included http://www.ladyada.net/library/eagle

## Net classes
1 power: width 0.305 mm
2 gnd: width 0.254 mm

## Board
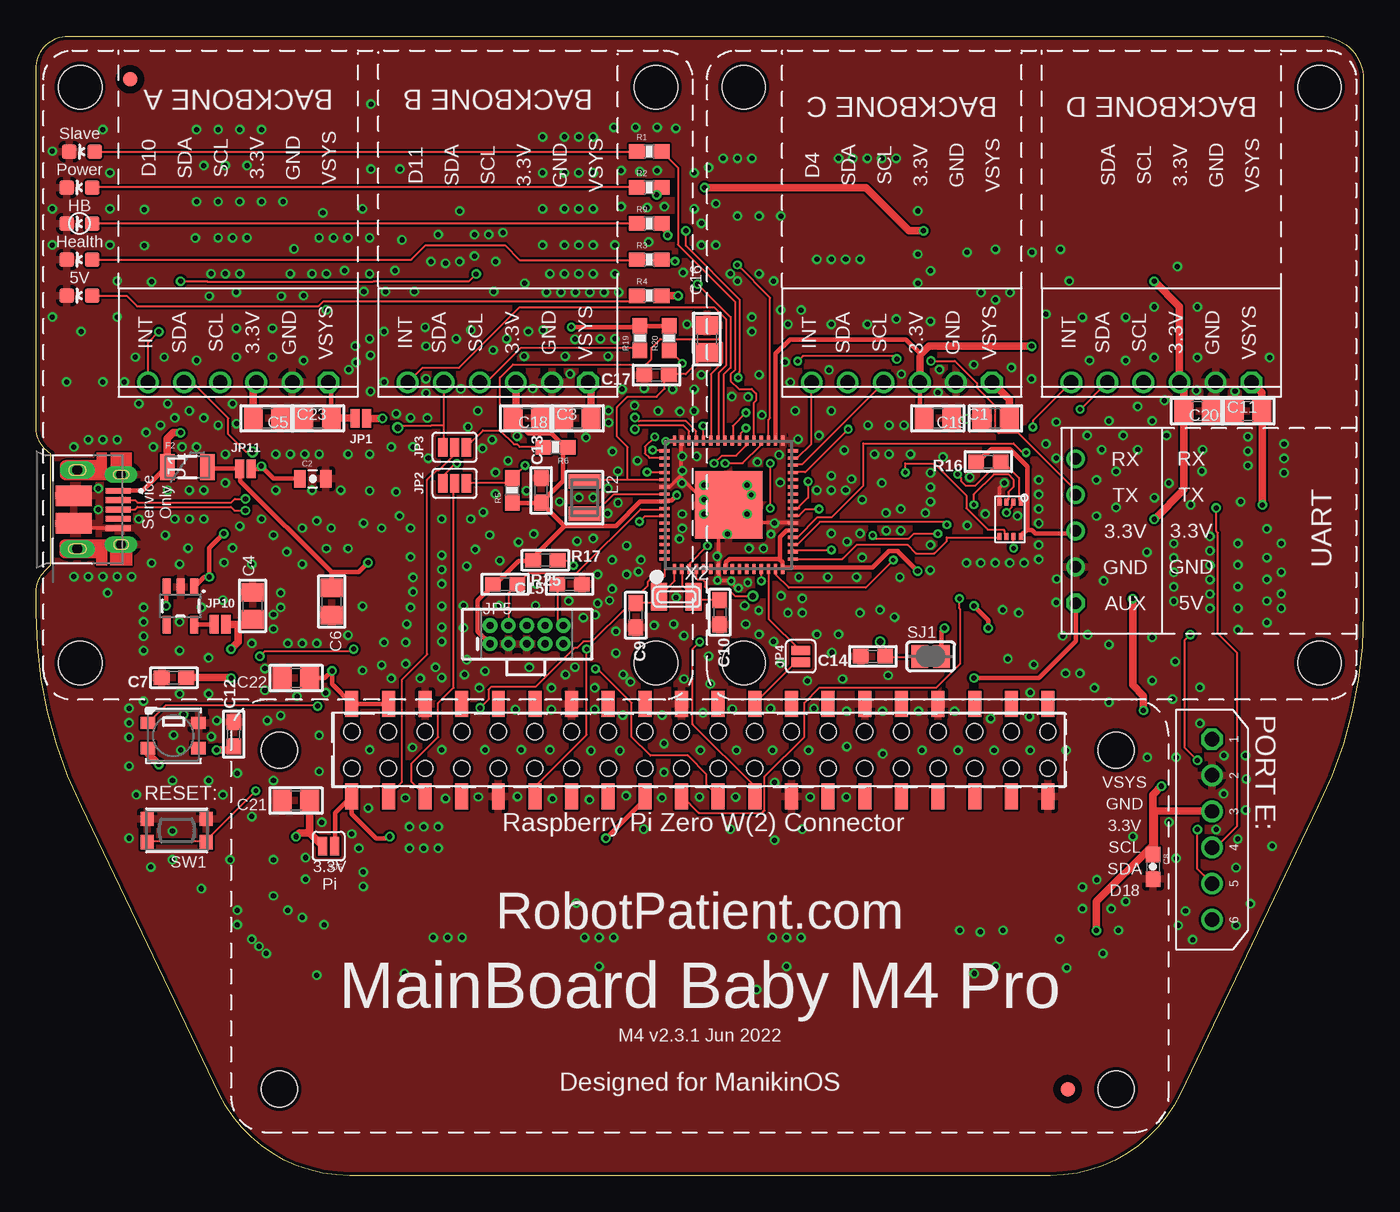
[diagram p3: board, top side]
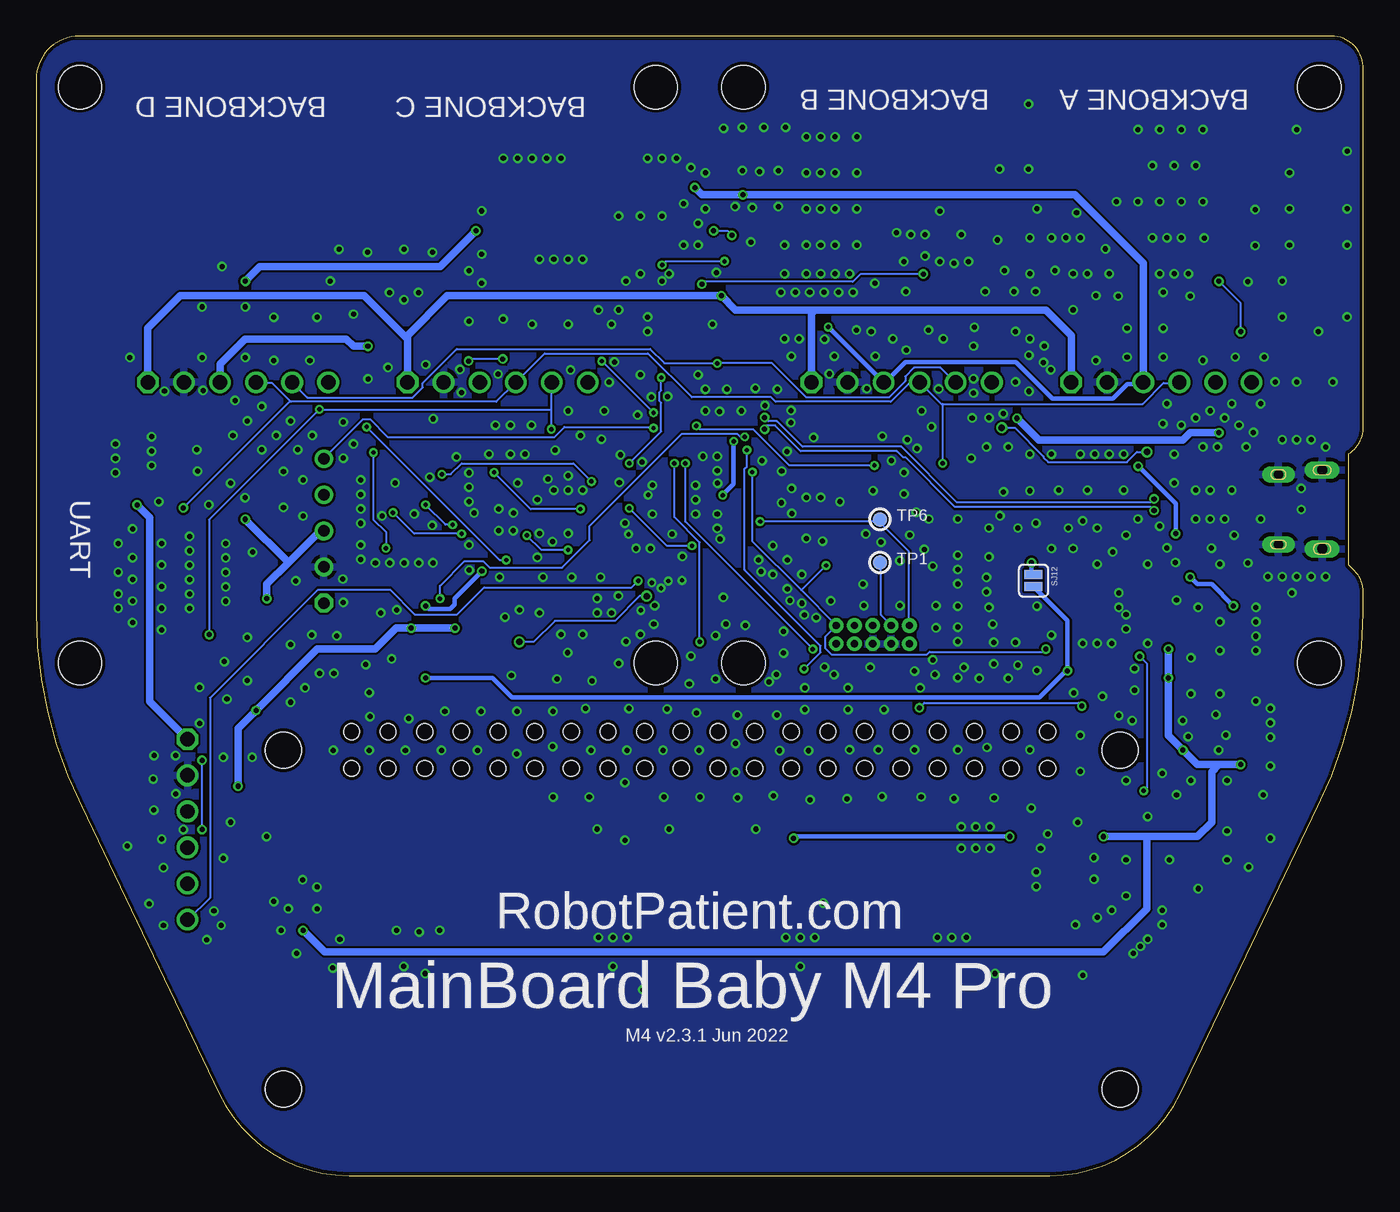
[diagram p4: board, bottom side, seen from below]

Size 92.01 x 79 mm. Coordinates in mm from the lower left corner, seen from the top.
Outline: 2.01,79 89.01,79 arc-90 92.01,76 92.01,38.99 arc-26 88.86,25.61 79.32,5.68 arc-64 70.31,0 21.72,0 arc-64 12.7,5.68 3.16,25.61 arc-26 0.01,38.99 0.01,40.49 arc-45 0.6,41.91 1.01,42.32 1.01,50.07 0.89,50.14 arc-56 0.01,51.8 0.01,76.5 arc-90 2.01,79
Copper layers (1*16): Top 0.035mm / dielectric 1.5mm / Bottom 0.035mm
Design rules "SeeedStudio_2layer_DRU_no_angle_20140221": minimum track width 6mil, minimum drill 12mil, track to track 6mil, track to pad 6mil, pad to pad 6mil, via to via 6mil, smd to smd 0mil, copper to edge 10mil, drill to drill 10mil, minimum pad ring 10mil, minimum via ring 6mil, stop-mask expansion 2mil, vias tented up to drill 100mil, thermal gap 10mil

### Footprints (pad centres in the part's own frame; a part is rotated, then mirrored left to right if it is on the bottom)
0805 = smd 1.3 x 1.5: 1 -0.95,0; 2 0.95,0
0805-CAP = smd 0.8 x 1.2: 1 -0.9,0; 2 0.9,0
0603 = smd 1.1 x 1: 1 -0.85,0; 2 0.85,0
0603-CAP = smd 1.1 x 1: 1 -0.85,0; 2 0.85,0
LED-0603 = smd 1 x 1: A 0,-0.877; C 0,0.877
PTC-1206 = smd 1 x 1.8: 1 -1.4,0; 2 1.4,0
AMPHENOL_10103594-0001LF = smd 0.4 x 1.75: 1 -1.3,2.825; 2 -0.65,2.825; 3 0,2.825; 4 0.65,2.825; 5 1.3,2.825 | drill 0.65 pad 0.73 long: 6 -2.425,3.03; 7 2.425,3.03 | drill 0.7 pad 1.2 long: 8 -2.725,0; 9 2.725,0 | smd 1.05 x 2.1 bottom: 10 -2.425,3.03; 11 2.425,3.03 | smd 1.425 x 2.5: S1 -0.963,-0.25; S2 0.963,-0.25
SMT-JUMPER_2_NO_NO-SILK = smd 0.635 x 1.27: 1 -0.406,0; 2 0.406,0
SMT-JUMPER_3_2-NC_PASTE_SILK = smd 0.635 x 1.27: 1 -0.813,0; 2 0,0; 3 0.813,0
SMT-JUMPER_2_NC_PASTE_SILK = smd 0.635 x 1.27: 1 -0.406,0; 2 0.406,0
2X5-PTH-1.27MM = drill 0.508 pad 1: 1 -2.54,-0.635; 2 -2.54,0.635; 3 -1.27,-0.635; 4 -1.27,0.635; 5 0,-0.635; 6 0,0.635; 7 1.27,-0.635; 8 1.27,0.635; 9 2.54,-0.635; 10 2.54,0.635
INDUCTOR_1007 = smd 1.016 x 2.2: P$1 -1.127,0; P$2 1.127,0
LED3535 = smd 1 x 0.85: 1 -1.75,0.875; 2 -1.75,-0.875; 3 1.75,-0.875; 4 1.75,0.875
0603-RES = smd 1.1 x 1: 1 -0.85,0; 2 0.85,0
SOLDERJUMPER_CLOSEDWIRE = smd 1.168 x 1.6: 1 -0.762,0; 2 0.762,0 | smd 0.635 x 0.203: WIRE 0,0
SJ_2S = smd 0.635 x 1.27: 1 -0.412,0; 2 0.412,0
BTN_KMR2_4.6X2.8 = smd 0.9 x 1: A 2.05,0.8; A' -2.05,0.8; B 2.05,-0.8; B' -2.05,-0.8
TESTPOINT_ROUND_1MM = smd 1 x 1: P$1 0,0
USON8 = smd 0.5 x 0.275: 1 -1.2,0.75; 2 -1.2,0.25; 3 -1.2,-0.25; 4 -1.2,-0.75; 5 1.2,-0.75; 6 1.2,-0.25; 7 1.2,0.25; 8 1.2,0.75
PTSM_M6_THRHOLE = drill 1 octagon: P1 6.25,1 | drill 1: P2 3.75,1; P3 1.25,1; P4 -1.25,1; P5 -3.75,1; P6 -6.25,1
PTSM_M6_TH_UP_NEUTRAL = drill 1 octagon: P1 6.25,0 | drill 1: P2 3.75,0; P3 1.25,0; P4 -1.25,0; P5 -3.75,0; P6 -6.25,0
PQFN64-1 = smd 0.7 x 0.22: 1 -4.45,3.75; 2 -4.45,3.25; 3 -4.45,2.75; 4 -4.45,2.25; 5 -4.45,1.75; 6 -4.45,1.25; 7 -4.45,0.75; 8 -4.45,0.25; 9 -4.45,-0.25; 10 -4.45,-0.75; 11 -4.45,-1.25; 12 -4.45,-1.75; 13 -4.45,-2.25; 14 -4.45,-2.75; 15 -4.45,-3.25; 16 -4.45,-3.75; 33 4.45,-3.75; 34 4.45,-3.25; 35 4.45,-2.75; 36 4.45,-2.25; 37 4.45,-1.75; 38 4.45,-1.25; 39 4.45,-0.75; 40 4.45,-0.25; 41 4.45,0.25; 42 4.45,0.75; 43 4.45,1.25; 44 4.45,1.75; 45 4.45,2.25; 46 4.45,2.75; 47 4.45,3.25; 48 4.45,3.75 | smd 0.22 x 0.7: 17 -3.75,-4.45; 18 -3.25,-4.45; 19 -2.75,-4.45; 20 -2.25,-4.45; 21 -1.75,-4.45; 22 -1.25,-4.45; 23 -0.75,-4.45; 24 -0.25,-4.45; 25 0.25,-4.45; 26 0.75,-4.45; 27 1.25,-4.45; 28 1.75,-4.45; 29 2.25,-4.45; 30 2.75,-4.45; 31 3.25,-4.45; 32 3.75,-4.45; 49 3.75,4.45; 50 3.25,4.45; 51 2.75,4.45; 52 2.25,4.45; 53 1.75,4.45; 54 1.25,4.45; 55 0.75,4.45; 56 0.25,4.45; 57 -0.25,4.45; 58 -0.75,4.45; 59 -1.25,4.45; 60 -1.75,4.45; 61 -2.25,4.45; 62 -2.75,4.45; 63 -3.25,4.45; 64 -3.75,4.45 | smd 4.7 x 4.7: EXP 0,0
SENSORHUB_HOLES = hole 3: -19.96,19.96; 19.96,19.96; -19.96,-19.96; 19.96,-19.96
PI_SMT_ZERO = smd 0.9 x 1.8: P$1 -24.13,-3.2; P$2 -24.13,3.2; P$3 -21.59,-3.2; P$4 -21.59,3.2; P$5 -19.05,-3.2; P$6 -19.05,3.2; P$7 -16.51,-3.2; P$8 -16.51,3.2; P$9 -13.97,-3.2; P$10 -13.97,3.2; P$11 -11.43,-3.2; P$12 -11.43,3.2; P$13 -8.89,-3.2; P$14 -8.89,3.2; P$15 -6.35,-3.2; P$16 -6.35,3.2; P$17 -3.81,-3.2; P$18 -3.81,3.2; P$19 -1.27,-3.2; P$20 -1.27,3.2; P$21 1.27,-3.2; P$22 1.27,3.2; P$23 3.81,-3.2; P$24 3.81,3.2; P$25 6.35,-3.2; P$26 6.35,3.2; P$27 8.89,-3.2; P$28 8.89,3.2; P$29 11.43,-3.2; P$30 11.43,3.2; P$31 13.97,-3.2; P$32 13.97,3.2; P$33 16.51,-3.2; P$34 16.51,3.2; P$35 19.05,-3.2; P$36 19.05,3.2; P$37 21.59,-3.2; P$38 21.59,3.2; P$39 24.13,-3.2; P$40 24.13,3.2 | hole 1.1: -24.13,-1.27; -24.13,1.27; -21.59,-1.27; -21.59,1.27; -19.05,-1.27; -19.05,1.27; -16.51,-1.27; -16.51,1.27; -13.97,-1.27; -13.97,1.27; -11.43,-1.27; -11.43,1.27; -8.89,-1.27; -8.89,1.27; -6.35,-1.27; -6.35,1.27; -3.81,-1.27; -3.81,1.27; -1.27,-1.27; -1.27,1.27; 1.27,-1.27; 1.27,1.27; 3.81,-1.27; 3.81,1.27; 6.35,-1.27; 6.35,1.27; 8.89,-1.27; 8.89,1.27; 11.43,-1.27; 11.43,1.27; 13.97,-1.27; 13.97,1.27; 16.51,-1.27; 16.51,1.27; 19.05,-1.27; 19.05,1.27; 21.59,-1.27; 21.59,1.27; 24.13,-1.27; 24.13,1.27 | hole 2.5: -29.139,-23.5; 28.861,-23.5; -29.139,0; 28.861,0
PTSM_M5_TH_UART = drill 0.8 octagon: P1 5,-0.27 | drill 0.8: P2 2.5,-0.27; P3 0,-0.27; P4 -2.5,-0.27; P5 -5,-0.27
FIDUCIAL_1MM = smd 1 x 1: 1 0,0
SOT23-5 = smd 0.55 x 1.2: 1 -0.95,-1.3; 2 0,-1.3; 3 0.95,-1.3; 4 0.95,1.3; 5 -0.95,1.3
XTAL3215 = smd 1.1 x 1.9: P$1 1.2,0; P$2 -1.2,0

### Placement (x,y rotation side)
C1  62.51,52.5 0 top
C2  19.18,48.31 0 top
C3  34.01,52.5 0 top
C4  15.01,39.5 90 top
C5  19.51,52.5 180 top
C6  20.49,39.8 270 top
C7  9.56,34.52 180 top
C8  77.42,21.41 270 top
C9  41.57,38.84 270 top
C10  47.4,39.06 270 top
C11  80.51,53 0 top
C12  13.7,30.6 90 top
C13  35.01,47.5 90 top
C14  58.01,36 180 top
C15  36.98,41 180 top
C16  46.51,58 90 top
C17  43.01,55.5 180 top
C18  37.51,52.5 180 top
C19  66.51,52.5 180 top
C20  84.01,53 180 top
C21  18.01,26 180 top
C22  18.01,34.5 180 top
C23  16.01,52.5 0 top
D1  3.01,61 90 top
D2  3.01,68.5 90 top
D3  3.01,63.5 90 top
F2  10.49,49.12 0 top
HB_LED  3.01,66 90 top
HB_LED1  3.19,70.98 90 top
J1  2.86,46.18 270 top
JP1  22.51,52.5 180 top
JP2  29.01,48 0 top
JP3  29.01,50.5 0 top
JP4  53.01,36 90 top
JP5  34.01,37.5 0 top
JP10  12.76,38.22 0 top
JP11  14.51,49 0 top
L2  38.01,47 270 top
LED3  9.51,30.5 0 top
R1  42.51,71 0 top
R2  42.51,68.5 0 top
R3  42.51,63.5 0 top
R4  42.51,61 0 top
R5  33.01,47.5 90 top
R6  36.01,50.5 180 top
R9  42.51,66 0 top
R16  66.01,49.5 180 top
R17  35.3,42.66 0 top
R19  41.86,58.06 90 top
R20  43.89,58.06 90 top
R25  32.51,41 0 top
SJ1  62.01,36 0 top
SJ5  20.28,22.84 180 top
SJ12  22.87,41.25 270 bottom
SW1  9.75,23.93 180 top
TP1  33.51,42.5 0 bottom
TP6  33.51,45.5 0 bottom
U1  67.51,45.5 270 top
U$2  14.01,54 0 top
U$3  78.01,54 0 top
U$5  60.01,54 0 top
U$6  81.51,24 90 top
U$14  48.01,46.5 90 top
U$15  69.01,55.5 0 top
U$16  23.01,55.5 0 top
U$17  46.01,29.5 0 top
U$22  32.01,54 0 top
U$24  72.33,44.7 270 top
U$34  71.51,6 0 top
U$35  6.51,76 0 top
V_REG_AP2112K  10.01,39.5 180 top
X2  44.38,40.12 180 top

### Tracks (layer width: path | path; a pad name or v marks a point on that pad's centre or on a via)
3.3V  (via drill 0.3, 0.35)
  Top 0.305: SJ1.2 62.78,37.76 v62.97,37.96 | v65.01,39.5 66.01,38.5 v66.01,37.96 | C1.1 61.26,52.8 U$5.P3 | R2.2 43.01,68.15 v43.01,68 | 51.5,42.75 48.07,42.75 47.84,42.52 47.84,42.07 47.77,41.99 U$14.8 | 51.5,42.75 51.73,42.52 51.73,42.07 U$14.16 51.88,42.14 57.98,42.14 59.12,43.29 59.74,43.29 59.74,43.28 59.74,43.27 v61.11,41.9 | U$14.21 52.41,44.73 52.03,44.73 51.58,44.28 51.58,42.83 51.5,42.75 | U$14.34 51.27,50.98 51.27,56.97 52.27,57.97 60.3,57.97 61.32,56.95 61.26,56.75 | R20.2 43.88,58.91 41.9,58.91 R19.2 41.75,58.83 v37.1,58.83 | C3.1 33.21,52.36 34.13,51.44 35.73,51.44 36.64,50.53 36.79,50.53 R6.1 36.53,50.44 36.53,48.16 36.52,48.16 C13.1 | JP5.1 31.46,36.89 30.62,37.72 30.62,39.86 31.61,40.85 R25.1 31.69,41 31.84,41 33.44,42.6 34.43,42.6 R17.1 34.51,42.75 34.51,42.91 36.64,45.04 | 36.64,45.04 40.2,45.04 41.88,46.72 43.5,46.72 U$14.56 43.65,46.79 44.03,46.79 v44.41,47.17 | 36.64,45.04 35.04,46.64 C13.1 | v43.65,50.91 44.26,50.91 U$14.48 | R5.1 33.06,46.64 34.89,46.64 C13.1 | 68.71,44.8 68.34,44.43 68.26,44.38 U1.8 | 68.71,44.8 68.72,44.81 68.72,49.15 67.5,50.37 66.21,50.37 65.37,49.53 65.22,49.53 R16.2 | 68.71,44.8 68.76,44.75 69.01,44.75 69.26,44.5 72.01,44.5 72.01,44.62 U$24.P3
  Top 0.508: C4.1 14.68,38.22 14.01,38.22 | 14.01,38.22 JP10.2 | 14.01,38.22 14.01,37 v13.51,36.5 | C12.1 13.45,29.5 v12.51,29.5 | C7.1 13.49,34.52 v13.51,34.5 | LED3.2 7.76,29.25 v8.51,28.5 | SJ5.2 18.96,23.75 | 18.96,23.75 C21.1 | v18.01,23.5 18.27,23.75 18.96,23.75 | v73.51,17 73.51,19 77.51,23 | U$6.P3 81.48,25.28 77.51,25.28 77.51,23 | 77.51,23 77.51,22.35 C8.1 77.42,26.41 v78.01,27 | v69.01,57.5 61.88,57.5 61.32,56.95 | 61.26,56.75 U$5.P3 | v76.01,40 76.01,34 76.76,33.25 v76.76,32.25 | v77.51,45.5 79.56,47.55 C11.1 79.56,54.7 U$3.P3 79.26,60.25 v77.51,62 | C23.1 15.06,54.8 U$2.P3 | C3.1 33.26,52.7 U$22.P3 | v61.51,65.5 60.51,65.5 57.51,68.5 v46.35,68.5
  Bottom 0.305: v61.11,41.9 63.01,40.01 63.01,39.61 63.31,39.3 64.81,39.3 v65.01,39.5 | v37.1,58.83 33.29,55.02 U$22.P3 33.14,55.02 31.76,56.39 24.09,56.39 21.58,53.88 17.36,53.88 16.37,54.87 15.46,54.87 U$2.P3 | v43.65,50.91 43.65,47.94 v44.41,47.17
  Bottom 0.508: v13.51,36.5 v13.51,34.5 13.51,30.5 v12.51,29.5 11.51,28.5 10.01,28.5 | v8.51,28.5 10.01,28.5 | 10.01,28.5 10.51,28 10.51,24.5 11.51,23.5 15.01,23.5 | 15.01,23.5 v18.01,23.5 | 15.01,23.5 15.01,18.5 18.01,15.5 72.01,15.5 v73.51,17 | v78.01,27 78.01,31 v76.76,32.25 72.51,36.5 68.51,36.5 67.05,37.96 v66.01,37.96 v62.97,37.96 | U$3.P3 79.26,56.25 77.51,58 70.51,58 70.01,57.5 v69.01,57.5 | U$24.P3 72.32,44.7 74.51,42.5 | 74.51,42.5 76.01,41 v76.01,40 | 74.51,42.5 v77.51,45.5 | U$2.P3 15.26,63.25 20.01,68 v43.01,68 45.85,68 v46.35,68.5 | v61.51,65.5 64.01,63 76.51,63 v77.51,62
3.3V_IN  (via drill 0.35)
  Top 0.305: V_REG_AP2112K.3 9.01,40.75 v9.01,39.5 | v13.01,44.5 12.01,43.5 v12.01,41.5 11.66,41.5 V_REG_AP2112K.1 | JP11.2 15.43,49 v15.61,49.18 16.48,48.31 C2.1
  Bottom 0.305: v9.01,39.5 10.51,41 11.51,41 v12.01,41.5 | v13.01,44.5 13.01,46.58 v15.61,49.18
3.3V_PI  (via drill 0.35)
  Top 0.305: SJ5.1 20.72,22.87 20.72,25.15 21.86,26.29 U$17.P$1 21.88,25.07 23.56,23.39 24.4,23.39 v24.51,23.5 | U$17.P$17 42.2,26.1 v39.5,23.39
  Bottom 0.305: v24.51,23.5 39.39,23.5 v39.5,23.39
3V3_LED
  Top 0.152: D2.A 3.95,68.51 41.59,68.51 R2.1
5V  (via drill 0.35)
  Top 0.305: C22.1 20.01,34.5 v20.51,35 20.51,34.07 U$17.P$2 U$17.P$4 | U$24.P1 72.06,37.05 69.51,34.5 v65.01,34.5
  Bottom 0.305: SJ12.2 20.51,38.48 v20.51,35 20.64,34.98 22.47,33.15 59.01,33.15 60.36,34.5 v65.01,34.5
5V_LED
  Top 0.152: D1.A 6.27,61 7,60.27 19.59,60.27 19.89,60.58 41.24,60.58 R4.1
!RESET  (via drill 0.3, 0.35)
  Top 0.152: SW1.A 7.76,23.17 11.8,23.17 SW1.A' 11.8,23.25 v15.23,26.68 | v42.36,48.77 43.5,48.77 U$14.52 | v37.25,42.3 36.95,42.6 36.18,42.6 R17.2 | C15.2 36.18,40.92 36.18,38.49 36.49,38.18 JP5.10 | v22.01,36.5 21.84,36.33 15.84,36.33 v15.51,36
  Bottom 0.152: v42.36,48.77 42.36,43.97 38.97,40.58 | 38.97,40.58 36.56,38.18 JP5.10 36.56,38.11 37.33,37.34 37.33,36.58 36.87,36.12 30.27,36.12 30.08,36.31 22.2,36.31 v22.01,36.5 | 38.97,40.58 v37.25,42.3 | v15.51,36 15.01,35.5 15.01,26.89 v15.23,26.68
AREF  (via drill 0.45)
  Top 0.152: SJ1.1 61.18,35.97 58.89,35.97 C14.1 58.86,36.65 v58.51,37 | U$14.4 45.76,41.42 45.88,41.3 46.22,41.3 46.36,41.17 46.36,40.81 46.48,40.7 48,40.7 48.14,40.55 48.14,40.5 48.46,40.17 v49.68,40.17
  Bottom 0.152: v49.68,40.17 50.19,40.17 51.89,38.46 56.05,38.46 57.51,37 v58.51,37
CS0
  Top 0.152: JP4.1 52.95,35.59 52.64,35.59 49.82,32.77 U$17.P$24
D4_INT
  Top 0.152: U$14.31 52.49,49.76 52.8,49.76 53.71,50.68 53.71,54.95 U$5.P6
D5_HEALTH_LED  (via drill 0.3)
  Top 0.152: v44.29,63.39 44.18,63.5 R3.2 43.35,63.48 41.67,63.48 R3.1 41.59,63.48 33.53,63.48 32.51,64.5 27.01,64.5 26.01,63.5 D3.A | U$14.35 50.76,52.39 50.89,52.52 50.89,60.86 v48.61,63.14
  Bottom 0.152: v44.29,63.39 48.37,63.39 v48.61,63.14
D6_SLAVE_LED
  Top 0.152: U$14.37 49.75,50.98 49.75,53.57 49.91,53.73 49.91,54.23 49.6,54.53 48.71,54.53 48.15,55.1 48.15,55.55 48.45,55.86 48.45,60.58 44.49,64.55 44.49,69.88 43.42,70.95 R1.2
D6_SLAVE_LED1
  Top 0.152: HB_LED1.A 4.1,70.95 41.59,70.95 R1.1
D8_NEOPIX  (via drill 0.35)
  Top 0.152: v30.78,32.43 31.36,33.02 31.36,33.7 31.55,33.88 34.63,33.88 37.33,36.58 37.49,36.58 37.94,37.04 38.55,37.04 40.84,39.33 40.84,40.34 40.98,40.47 41.99,40.47 42.4,40.89 42.4,41.17 42.53,41.3 43.32,41.3 43.56,41.55 U$14.64 | LED3.1 8.98,32.59 19.48,32.59 v19.52,32.55
  Bottom 0.152: v30.78,32.43 30.44,32.77 19.73,32.77 v19.52,32.55
D9_GPIO17_CPRSTAT  (via drill 0.3)
  Top 0.152: v47,49.38 47.54,49.92 48.53,49.92 49.21,50.6 49.21,50.91 U$14.38 | v38.16,36.51 38.16,30.56 34.58,26.98 U$17.P$11
  Bottom 0.152: v47,49.38 47,45.34 v38.16,36.51
D10_INT  (via drill 0.35)
  Top 0.152: U$14.41 47.67,51.05 47.67,55.53 48.15,56.01 48.15,59.52 v45.86,61.8 | U$2.P6 7.76,57.75 v8.51,58.5 | v10.01,62 11.86,62 11.89,61.96 23.35,61.96 23.39,62 30.01,62 v30.51,62.5
  Bottom 0.152: v8.51,58.5 8.51,60.5 v10.01,62 | v30.51,62.5 34.86,62.5 35.39,61.96 45.7,61.96 v45.86,61.8
D11_INT
  Top 0.152: U$14.42 47.31,50.98 47.31,55.63 47.84,56.16 47.84,59.36 47,60.2 33.52,60.2 29.33,56.01 26.81,56.01 25.82,55.02 U$22.P6
D12_SDA
  Top 0.152: U$14.43 46.78,50.98 46.78,55.55 47.54,56.32 47.54,57.77 47.31,57.99 43.27,57.99 42.66,57.38 42.66,56.62 42.28,56.24 33.06,56.24 32.16,55.34 32.16,51.66 32.17,51.65 | R6.2 35.12,50.53 33.51,50.53 33.34,50.7 33.12,50.7 32.17,51.65 | JP3.3 30.98,51.65 32.17,51.65
D13_SCL  (via drill 0.3)
  Top 0.152: v46.24,51.97 46.24,50.98 U$14.44 | v33.9,49.23 33.06,48.39 R5.2 32.98,48.32 32.68,48.01 29.86,48.01 JP2.3
  Bottom 0.152: v46.24,51.97 46.02,51.75 42.32,51.75 39.8,49.23 v33.9,49.23
D14_HB  (via drill 0.3, 0.35)
  Top 0.152: v46.55,43.67 45.33,42.45 45.33,42.07 U$14.3 | v50.89,49.38 v50.89,46.26 | v48.68,55.33 48.68,55.63 48.76,55.71 48.76,60.74 45.04,64.45 v45.04,65.49 v45.05,65.5 | v43.78,65.19 43.36,65.62 R9.2
  Bottom 0.152: v46.55,43.67 48.3,43.67 v50.89,46.26 | v50.89,49.38 48.68,51.59 48.68,53.58 48.79,53.7 48.79,54.33 48.68,54.44 v48.68,55.33 | v45.05,65.5 44.09,65.5 v43.78,65.19
D14_HB_LED
  Top 0.152: HB_LED.A 3.95,66 41.59,66 R9.1
D15_SS
  Top 0.152: U$14.14 50.81,41.99 50.81,38.56 52.95,36.43 JP4.2
D18_INT  (via drill 0.3)
  Top 0.152: v50.28,41.23 50.28,41.99 U$14.13
  Bottom 0.152: v50.28,41.23 50.73,40.78 60.94,40.78 62.81,38.91 65.77,38.91 67.48,40.62 72.45,40.62 79.95,33.13 79.95,19.26 81.45,17.75 U$6.P6
D19_INT  (via drill 0.3)
  Top 0.152: v59.42,42.68 57.52,40.77 52.19,40.77 51.27,41.69 51.27,41.99 U$14.15 | v69.1,51.9 69.1,52.36 71.69,54.95 U$3.P6
  Bottom 0.152: v59.42,42.68 59.88,42.68 v69.1,51.9
GND  (via drill 0.3, 0.35)
  Top 0.254: 44.64,48.47 44.72,48.55 44.72,50.91 U$14.47 | 44.64,48.47 43.96,47.78 43.58,47.78 U$14.54 | U$14.EXP 47.99,46.49 47.31,45.8 47.31,42.07 U$14.7 47.33,41.98 47.33,41.43 47.52,41.24 48.07,41.24 48.58,40.73 v48.69,40.73 | U$14.22 52.41,45.27 49.21,45.27 48.07,46.41 U$14.EXP | C18.2 | 44.64,48.47 47.23,45.88 U$14.EXP | U1.4 66.76,47.66 v67.12,48.02 | J1.S2 2.95,44.88 J1.5
  other vias: 33.99,47.49 30.99,45.99 34.49,44.49 37.49,43.99 39.96,50.2 41.69,49.56 44.79,49.86 44.79,44.87 49.29,47.87 46.29,47.87 49.29,45.87 46.29,45.87 47.92,44.48 50.42,43.48 51.19,45.23 51.65,40.19 44.37,40.09 49.19,38.23 44.19,38.23 40.19,36.23 37.93,38.68 38.93,39.68 39.93,40.68 40.93,41.68 41.93,42.68 40.93,43.68 39.93,42.68 38.93,41.68 37.62,47.02 34.62,39.52 32.12,39.52 29.62,39.52 28.12,41.02 28.12,42.02 28.12,43.02 28.12,38.02 28.12,37.02 28.12,34.52 25.62,35.48 22.62,35.02 28.12,45.52 30.12,45.52 31.62,51.02 30.62,53.02 27.12,52.52 29.12,58.02 34.12,58.52 39.12,58.02 40.12,58.02 45.62,54.52 45.62,53.02 43.12,53.02 40.62,54.52 49.62,58.52 50.12,55.52 52.62,53.02 55.12,53.02 55.12,59.02 52.12,59.02 57.62,59.02 57.12,63.52 55.12,63.52 56.12,63.52 54.12,63.52 59.62,70.52 58.62,70.52 57.62,70.52 56.62,70.52 55.62,70.52 47.62,70.52 48.62,70.52 49.62,70.52 38.62,69.52 38.62,72.02 38.62,67.02 38.62,64.52 38.62,62.52 35.62,62.52 35.12,64.52 35.12,67.02 35.12,69.52 35.12,72.02 23.12,58.02 23.12,62.52 23.12,65.02 22.62,67.02 17.12,67.52 14.62,65.02 14.12,62.52 15.62,67.52 14.12,67.52 14.62,70.02 13.12,70.02 11.62,70.02 12.62,72.52 14.12,72.52 15.62,72.52 11.12,72.52 32.62,58.02 26.12,50.52 24.62,50.52 22.12,57.52 24.12,58.52 20.12,60.02 20.12,62.52 17.62,62.52 21.62,65.02 20.62,65.02 19.62,65.02 19.12,62.52 13.12,62.52 12.12,62.52 13.62,65.02 12.62,65.02 12.62,67.52 11.12,67.52 59.12,52.02 59.12,50.02 60.62,50.02 58.12,50.02 54.12,47.52 55.12,47.52 56.12,47.52 55.12,48.52 57.12,44.52 68.12,39.02 57.12,39.02 52.12,39.02 53.12,40.02 53.12,39.02 49.12,39.52 51.12,37.02 59.07,34.67 53.47,34.3 56.18,32.19 58.68,32.19 61.18,32.19 63.68,32.19 66.18,31.68 68.87,31.82 71.37,34.82 67.37,35.82 74.37,36.82 72.37,34.82 73.37,33.82 74.37,32.82 77.37,34.32 77.37,37.32 81.37,44.32 81.37,43.32 81.37,42.32 81.37,41.32 81.37,40.32 78.87,43.82 78.87,42.82 78.87,41.82 78.87,40.82 78.87,39.82 81.37,39.32 78.37,51.32 74.37,52.32 75.37,51.32 76.37,50.32 73.87,50.32 72.87,51.32 74.87,48.82 74.87,46.32 62.87,49.82 64.72,48.42 33.35,51.25 31.85,48.76 31.85,47.26 29.85,42.26 29.85,35.76 37.35,35.26 38.47,29.46 40.47,29.46 35.79,26.12 23.12,29.52 26.1,29.68 25.6,26.18 28.37,26.14 30.66,26.25 33.37,26.29 28.12,29.52 31.12,29.52 33.62,29.52 35.62,29.52 19.62,30.52 19.62,28.02 48.55,29.49 51.05,29.49 53.55,29.49 46.05,29.49 45.99,26.25 48.49,26.25 53.66,26.25 56.16,26.25 55.16,36.25 55.9,34.43 44.9,37.43 44.9,34.43 43.4,31.93 40.66,31.93 38.73,33.81 38.73,32.31 35.73,32.31 35.73,33.81 33.23,32.31 30.73,33.81 40.34,46.64 40.32,48.84 39.64,47.63 45.79,49.86 44.79,48.87 44.79,45.87 49.42,43.48 51.58,48.05 52.82,51.05 54.27,51.31 59.99,55.56 65.01,56.23 69.51,48.23 69.51,47.23 69.51,46.23 69.51,45.23 68.03,45.73 69.51,43.73 62.01,48.73 62.01,47.73 62.01,46.73 61.65,45.94 62.01,43.73 61.99,41.98 64.49,42.48 65.49,42.48 66.49,42.48 67.49,42.48 68.49,42.48 69.51,42.73 67.01,39.23 58.51,39.23 59.51,38.73 74.01,41.23 77.01,43.23 73.51,45.73 70.01,50.73 73.51,48.23 69.01,55.23 70.01,59.73 66.51,60.73 66.51,64.22 71.01,64.22 67.51,61.23 65.51,61.23 62.01,59.23 62.01,62.73 80.51,60.23 77.51,60.23 77.51,56.73 80.51,56.73 85.51,56.73 84.01,51.23 83.51,46.73 86.51,48.73 86.51,49.73 86.51,50.73 84.01,50.23 84.01,49.23 77.37,52.32 76.37,53.32 80.87,50.32 36.62,72.02 37.62,72.02 37.62,69.52 36.62,69.52 36.62,67.02 37.62,67.02 37.62,62.52 36.62,62.52 37.62,64.52 36.62,64.52 45.62,69.52 45.62,67.02 43.56,67.18 40.56,67.18 40.56,69.68 43.06,69.68 43.06,72.68 41.56,72.68 40.06,72.68 48.62,66.52 50.12,66.52 51.62,66.52 1.12,64.52 1.12,67.02 1.12,71.02 4.62,72.52 5.12,69.52 5.12,67.02 5.12,64.52 5.62,62.02 5.62,59.52 24.12,55.02 27.03,54.25 25.95,52.54 23.12,50.02 21.62,50.02 16.62,47.52 13.12,48.02 13.12,50.02 16.62,50.02 8.12,50.52 10.62,47.52 9.12,47.52 8.95,44.39 4.95,40.39 14.95,36.9 17.45,36.9 18.45,36.9 19.45,36.9 18.45,42.39 18.45,44.89 19.45,45.39 20.45,44.89 16.45,44.39 25.95,44.89 25.95,42.89 25.95,39.39 23.95,35.4 24.95,47.39 23.95,44.89 10.22,31.96 6.45,28.39 16.95,31.89 12.95,26.39 14.95,24.89 13.45,21.89 16.45,21.89 19.95,17.39 19.45,13.89 37.45,18.89 49.95,12.89 65.45,16.89 73.95,15.39 45.12,59.02 51.62,60.02 49.62,59.52 46.12,55.52 44.12,54.52 39.67,53.05 38.11,51.17 38.61,44.17 32.72,49.56 30.94,50.41 29.94,51.91 31.44,44.41 30.44,43.41 33.44,43.91 32.14,42.63 36.92,39.84 34.69,41.01 37.02,55.59 37.35,57.98 35.14,58.63 30.14,58.63 33.87,61.87 27.37,63.37 31.87,63.37 29.37,63.37 25.37,64.87 29.37,66.87 32.37,65.37 48.27,32.35 50.92,32.38 53.92,32.38 56.22,43.95 58.62,48.02 67.62,56.02 71.62,62.02 79.12,63.02 65.79,45.87 64.49,52.47 60.17,52.02 57.67,52.02 62.53,54.29 56.03,50.29 56.53,48.29 57.27,46.87 58.92,45.95 57.27,42.87 50,49.47 51.5,49.97 8,42.47 8,61.97 7.5,64.47 7.5,66.97 12,60.97 17,60.97 26.22,61.28 22.72,61.28 24.22,61.28 31.72,61.28 25.22,69.78 23.22,74.28 23.22,69.78 34.42,54.56 12.95,39.89 9.95,38.39 9.95,42.39 9.95,36.4 7.45,39.39 7.45,36.4 7.45,37.39 7.45,38.39 39.69,52.2 54.88,41.48 52.88,41.48 56.88,41.48 59.88,41.48 15.86,35.15 46.73,34.09 15.86,33.65 20.08,33.47 18.08,33.23 12.53,31.54 16.03,31.54 9.53,30.54 6.45,31.39 6.45,30.39 6.45,32.4 7.45,32.9 9.95,33.4 11.95,33.4 11.95,35.9 25.62,36.98 24.12,36.98 21.62,37.48 22.62,39.48 46.12,64.52 48.12,62.52 48.62,62.02 50.12,62.52 47.12,64.52 51.12,62.02 46.12,66.02 42.46,64.72 44.86,62.61 42.36,67.11 41.86,69.61 44.36,72.61 33.84,56.81 36.68,56.8 39.66,56.81 4.31,46.17 4.32,47.63 10.62,45.52 11.62,45.52 11.62,47.52 9.62,45.52 7.12,45.52 14.12,45.02 13.62,43.52 15.62,45.52 19.12,47.52 21.12,47.52 18.62,50.02 17.62,50.02 19.62,50.02 13.62,53.52 12.62,52.02 11.62,52.52 11.12,50.52 10.12,50.52 9.62,52.52 8.62,52.02 7.62,51.52 2.62,50.52 4.62,51.02 3.62,51.02 5.62,51.02 2.62,41.52 3.62,41.52 4.62,41.52 5.62,41.52 6.62,41.52 24.62,34.48 26.62,34.48 31.12,34.98 29.62,37.98 28.12,39.48 26.12,41.48 26.12,40.48 21.62,43.48 20.12,43.48 23.12,47.48 44.62,52.98 50.31,52.73 52.29,55.01 54.96,55.85 51.92,56.41 49.35,53.98 48.23,54.02 55.12,44.52 58.94,44.72 59.94,44.72 59.94,46.22 64.55,45.07 62.63,55.88 59.63,59.38 61.13,61.88 61.13,63.88 61.13,66.88 46.63,69.88 47.13,67.38 40.12,64.52 40.12,62.52 40.38,61.25 39.38,61.25 38.38,61.25 37.38,61.25 36.38,61.25 35.38,61.25 28.38,63.25 30.38,63.75 30.38,65.25 31.38,65.25 27.88,65.25 24.88,62.75 21.38,62.75 19.88,66.75 17.88,64.25 13.88,61.25 13.88,58.75 16.38,58.75 16.38,56.75 13.88,56.75 8.88,56.75 6.88,56.75 17.38,43.24 36.29,46.72 47.21,42.92 46.62,36.02 51.62,35.52 50.12,37.52 54.12,37.52 55.62,37.52 48.12,24.02 53.12,24.02 42.12,24.02 38.36,26.05 40.9,26.33 43.38,26.19 26.88,24.19 25.88,24.19 27.88,24.19 25.88,22.69 26.88,22.69 27.88,22.69 22.38,22.69 21.88,23.69 23.03,25.48 19.8,24.49 18.68,22.05 22.68,21.05 18.68,20.55 22.68,20.05 15.95,15.39 14.95,16.39 15.45,15.89 13.95,17.39 13.95,18.39 16.45,19.39 18.45,17.89 17.45,18.39 9.45,23.89 9.45,21.89 6.95,26.39 13.95,27.89 16.45,27.39 40.19,37.73 41.19,34.23 40.69,34.73 36.69,34.73 34.19,35.23 29.69,34.73 27.69,35.23 25.69,38.23 25.19,45.73 22.69,45.23 27.19,49.73 31.69,57.23 29.44,54.54 27.03,55.25 42.15,54.59 41.48,53.39 39.62,45.91 38.62,47.02 42.84,38.14 43.53,29.95 43.53,27.95 51.2,27.25 51.2,23.24 56.2,29.75 58.7,29.25 61.41,29.48 63.91,29.48 66.41,29.48 68.91,29.48 71.41,29.48 68.91,33.48 69.16,35.42 71.16,37.42 72.9,37.48 70.76,41.36 70.72,39.74 70.72,49.74 70.72,52.24 78.22,53.74 80.44,54.44 83.11,54.39 83.32,43.84 83.32,42.34 83.32,40.84 83.32,39.34 83.32,37.84 86.32,39.34 86.32,40.34 85.32,41.34 85.32,39.84 85.32,38.34 85.32,42.84 86.32,41.84 85.32,44.84 86.32,43.84 80.82,48.84 80.03,46.51 78.53,48.01 77.53,47.01 75.53,56.5 73.03,56.5 72.53,59.5 75.53,59.5 69.03,64 64.53,64 53.03,60 27.03,57.5 18.53,56.5 18.53,61 11.03,65 10.53,43.51 13.03,42.51 10.03,29.5 25.53,14 27.53,16.5 29.53,16.5 28.53,16.5 38.03,16.5 39.03,16.5 40.03,16.5 39.03,14.5 51.03,16.5 52.03,16.5 53.03,16.5 52.03,14.5 64.03,17.01 67.03,17.01 66.53,14.5 65.03,14 72.53,18.51 73.53,20.51 72.53,20.01 74.53,18.51 75.53,19.01 75.03,17.01 76.03,23.51 78.53,24.51 79.03,22.01 77.03,29 79.03,29 80.68,31.35 80.68,33.85 78.97,35.64 78.78,33.03 83.85,25.35 85.68,22.85 84.18,18.85 83.18,21.35 83.18,17.35 79.68,18.35 80.18,16.35 79.18,17.35 70.95,16.39 71.45,14.39 46.23,32.09 1.12,59.52 3.12,58.52 2.12,55.02 4.62,55.02 38.75,38.87 39.75,39.87 41.75,41.87 44.6,44.14 10.62,53.02 11.12,56.52 7.12,53.52 6.12,55.02 9.12,53.52 13.9,52.13 23.18,54.37 21.68,55.87 22.18,56.37 23.18,56.87 48.18,41.23 47.24,41.27 49.33,41.11 50.09,39.19 50.94,44.48 49.59,47.19 46.29,46.87 44.77,48.01 16.95,40.39 16.45,38.89 16.95,39.39 16.45,37.89 14.95,42.39 11.45,39.39 82.34,29.12 83.84,29.12 82.32,26.46 83.89,27.49 81.8,23.99 83.3,23.34 12.14,30.43 9.45,27.39 11.95,27.39 7.95,21.39 6.45,23.39 11.45,19.89 24.97,52.82 26.97,58.82
  pour Top: -5.99,84 -5.99,-3.5 102.51,-3.5 102.51,84
  pour Bottom: -5.99,83 -5.99,-5 102.01,-5 102.01,83
MISO  (via drill 0.3)
  Top 0.152: v42.74,50.3 43.5,50.3 U$14.49 | v38.77,35.13 38.93,35.13 41.29,32.77 41.29,30.41 42.58,29.11 45.18,29.11 46.47,27.82 46.47,27.13 47.23,26.37 U$17.P$21
  Bottom 0.152: v42.74,50.3 42.74,49.15 42.89,49 42.89,41.99 37.63,36.73 37.63,36.28 v38.77,35.13
MOSI  (via drill 0.3)
  Top 0.152: v42.89,51.21 42.2,50.53 42.2,50.07 42.51,49.76 43.5,49.76 U$14.50 | v64.01,40 64.01,39.31 64.07,39.25 64.07,35.52 62.4,33.84 54.32,33.84 53.25,32.77 53.25,30.41 50.51,27.67 50.51,25.3 50.36,25.15 45.94,25.15 44.79,26.29 U$17.P$19
  Bottom 0.152: v42.89,51.21 43.19,51.21 43.42,51.44 47.23,51.44 53.63,45.04 53.63,44.05 55.54,42.14 60.57,42.14 61.02,42.6 62.3,42.6 64.01,40.88 v64.01,40
N$9
  Top 0.305: V_REG_AP2112K.5 12.34,38.2 JP10.1
N$16
  Top 0.152: U$14.1 44.26,41.99 44.26,41.23 43.19,40.16 X2.P$1 43.12,40.09 42.74,39.71 41.59,39.71 C9.1
N$17
  Top 0.152: U$14.2 44.79,41.99 44.79,40.92 45.56,40.16 X2.P$2 45.63,40.09 45.78,39.93 47.39,39.93 C10.1
N$18
  Top 0.152: U$14.55 43.5,47.25 40.05,47.25 38.72,45.92 L2.P$2
QSPI_CS  (via drill 0.3)
  Top 0.152: U1.1 68.26,46.75 68.14,46.88 68.14,48.38 67.01,49.5 R16.1 66.76,49.5 65.07,47.81 65.07,47.82 64.44,47.82 64.14,48.12 64.14,48.38 v63.89,48.62 | U$14.24 52.89,46.25 52.89,46.38 53.51,47 v53.51,48.12
  Bottom 0.152: v53.51,48.12 54.76,49.38 62.51,49.38 63.26,48.62 v63.89,48.62
QSPI_DATA[0]
  Top 0.152: U$14.17 55.89,42.75 56.89,43.75 60.39,43.75 61,43.13 62.27,43.13 63.14,44 63.14,44.25 66.76,44.25 U1.5
QSPI_DATA[1]  (via drill 0.3)
  Top 0.152: v67.27,45.97 67.64,46.34 67.64,46.5 67.76,46.62 U1.2 | v58,44.38 58.24,44.14 60.48,44.14 60.84,44.5 v62.51,44.5 | v55.14,43.38 52.51,43.38 52.51,43.25 U$14.18
  Bottom 0.152: v67.27,45.97 65.8,44.5 v62.51,44.5 | v58,44.38 56.99,43.38 v55.14,43.38
QSPI_DATA[2]  (via drill 0.3)
  Top 0.152: v65.01,46.5 65.01,47.24 66.39,48.62 67.39,48.62 67.76,48.25 67.76,47.75 67.39,47.38 67.39,46.88 67.26,46.75 U1.3 | v63.14,45.12 62.94,45.33 54.34,45.33 52.76,43.75 U$14.19
  Bottom 0.152: v65.01,46.5 63.64,45.12 v63.14,45.12
QSPI_DATA[3]  (via drill 0.3)
  Top 0.152: v67.76,43.5 U1.7 | v68.64,50.12 68.39,50.12 67.76,50.75 57.35,50.75 57.35,47.84 55.16,45.65 54.16,45.65 52.76,44.25 U$14.20
  Bottom 0.152: v67.76,43.5 67.76,44.62 68.64,45.5 v68.64,50.12
QSPI_SCK  (via drill 0.3)
  Top 0.152: v60.26,48.75 60.26,49.38 62.26,49.38 64.48,47.16 64.48,46.28 65.98,44.78 67.06,44.78 67.14,44.7 67.14,44.5 67.26,44.38 U1.6 | v54.28,46.21 53.35,46.21 52.89,45.75 U$14.23
  Bottom 0.152: v60.26,48.75 57.72,46.21 v54.28,46.21
RX_D0  (via drill 0.3, 0.35)
  Top 0.152: v49.21,52.89 48.3,51.97 48.3,50.98 U$14.40 | U$24.P4 72.06,47.51 68.11,51.47 66.71,51.47 66.51,51.67 66.51,53.34 65.22,54.64 65.22,54.95 63.68,56.48 v62.03,56.48 | v52.8,56.47 53.16,56.83 59.46,56.83 v59.67,56.62
  Bottom 0.152: v52.8,56.47 v49.21,52.89 | v59.67,56.62 61.89,56.62 v62.03,56.48
SCK  (via drill 0.3)
  Top 0.152: v47.77,49.38 48.99,49.38 50.2,50.6 50.2,50.91 U$14.36 | U$17.P$23 49.82,26.98 45.51,31.29 45.51,36.5 v46.01,37
  Bottom 0.152: v47.77,49.38 47.77,45.65 46.01,43.9 v46.01,37
SCL  (via drill 0.3, 0.35)
  Top 0.152: R19.1 41.7,57.37 33.59,57.37 31.22,55 U$22.P4 | v29.17,49.38 29.1,49.38 28.26,48.55 28.26,48.01 JP2.1 | U$14.30 52.49,49.31 53.1,49.31 58.74,54.95 U$5.P4 | U$6.P4 81.78,22.75 83.27,24.23 83.27,36.24 81.92,37.59 81.92,44.55 81.8,44.67 v81.8,46.29
  Bottom 0.152: v29.17,49.38 29.17,53.42 29.21,53.46 | 29.21,53.46 30.7,54.95 U$22.P4 30.77,54.95 31.46,54.95 32.75,53.65 40.75,53.65 41.07,53.96 46.56,53.96 49.59,57 56.76,57 58.74,55.02 U$5.P4 58.82,54.95 60.11,53.65 74.36,53.65 74.4,53.69 | U$2.P4 12.79,54.95 13.86,54.95 15.3,53.5 29.17,53.5 29.21,53.46 | 74.4,53.69 75.66,54.95 76.72,54.95 U$3.P4 | 74.4,53.69 v81.8,46.29
SCL_PI
  Top 0.152: JP2.2 28.94,47.94 28.94,33.84 27.88,32.77 27.88,30.41 26.05,28.58 26.05,27.29 26.96,26.37 U$17.P$5
SDA  (via drill 0.3, 0.35, 0.45)
  Top 0.152: v44.79,56.32 43.96,57.16 R20.1 | 28.26,52 28.26,54.95 U$22.P5 | 28.26,52 28.26,50.53 JP3.1 | U$2.P5 10.28,54.95 10.89,54.95 13.32,52.51 13.32,51.4 14.56,50.16 v15.01,50.16 | v56.3,51.75 53.33,48.77 52.49,48.77 U$14.29 | v72.38,53.12 74.21,54.95 U$3.P5 | 28.26,52 27.39,52 27.35,51.96 25.18,51.96 v25.06,51.85 | U$6.P5 80.51,21.25 v80.51,24 | v80.51,28.8 79.61,29.7 79.61,37.1 v80.01,37.5
  Bottom 0.152: U$22.P5 28.34,55.02 29.33,56.01 31.15,56.01 31.76,55.4 31.76,55.1 32.91,53.95 38.62,53.95 40.98,56.32 v44.79,56.32 48.45,56.32 49.44,57.31 62.85,57.31 65.22,54.95 65.22,54.64 65.9,53.95 73.22,53.95 74.21,54.95 U$3.P5 | 56.3,53.12 56.3,54.95 U$5.P5 | 56.3,53.12 v56.3,51.75 | 56.3,53.12 v72.38,53.12 80.01,45.48 v80.01,37.5 | v25.06,51.85 24.17,51.85 22.18,49.86 22.18,49.79 21.85,49.46 16.39,49.46 15.69,50.16 v15.01,50.16 | v80.51,24 v80.51,28.8
SDA_PI
  Top 0.152: JP3.2 28.94,50.45 28.94,49.92 27.95,48.93 27.8,48.93 27.12,48.24 27.12,36.14 25.36,34.39 25.36,27.29 24.45,26.37 U$17.P$3
SWCLK
  Top 0.152: U$14.57 43.5,46.18 41.9,46.18 37.48,41.76 34.13,41.76 R25.2 33.29,40.92 32.75,40.39 32.75,38.18 JP5.4
  Bottom 0.152: TP1.P$1 33.44,42.45 33.44,38.87 32.75,38.18 JP5.4
SWDIO  (via drill 0.3)
  Top 0.152: v41.82,45.34 42.2,45.73 43.5,45.73 U$14.58
  Bottom 0.152: v41.82,45.34 33.67,45.34 TP6.P$1 33.59,45.34 31.54,43.29 31.54,38.18 JP5.2
TX_D1  (via drill 0.3)
  Top 0.152: v49.21,51.82 48.83,51.44 48.83,50.98 U$14.39
  Bottom 0.152: v49.21,51.82 49.29,51.9 55.38,51.9 56.07,51.21 67.65,51.21 68.87,52.43 69.33,52.43 72,49.76 U$24.P5
USB_D_N  (via drill 0.35)
  Top 0.152: U$14.45 45.76,51.61 45.06,52.3 41.76,52.3 v41.51,52.56 | J1.2 6.87,46.83 7.04,46.66 13.51,46.66 13.77,46.91 v14.51,46.91
  Bottom 0.152: v14.51,46.91 14.76,46.66 28.18,46.66 32.04,50.52 38.89,50.52 40.67,52.3 41.27,52.3 41.28,52.31 41.28,52.32 v41.51,52.56
USB_D_P  (via drill 0.35)
  Top 0.152: U$14.46 45.26,51.61 44.87,52 41.76,52 v41.51,51.75 | J1.3 6.87,46.18 7.04,46.35 13.51,46.35 13.76,46.11 v14.51,46.11
  Bottom 0.152: v14.51,46.11 14.76,46.36 28.3,46.36 31.73,49.78 31.9,49.78 32.34,50.22 39.01,50.22 40.79,52 41.41,52 41.51,51.9 v41.51,51.75
VDDCORE1
  Top 0.152: C16.1 46.47,57 45.02,55.55 43.88,55.55 C17.1 43.8,55.48 43.58,55.48 43.58,54.76 43.57,54.75 43.57,54.55 43.01,54 41.01,54 40.28,53.27 40.28,51.23 41.01,50.5 41.01,48.24 | 41.01,48.24 38.16,48.24 38.09,48.16 L2.P$1 | 41.01,48.24 43.5,48.24 U$14.53
VIN  (via drill 0.35)
  Top 0.305: F2.2 11.95,49.08 12.03,49 14.09,49 JP11.1 14.16,48.85 14.16,48.16 20.49,41.83 | C6.1 20.49,41.83 | 20.49,41.83 22.35,41.83 v23.01,42.5
  Bottom 0.305: v23.01,42.5 23.01,41.8 SJ12.1
VIN_USB  (via drill 0.35)
  Top 0.305: 22.93,52.47 JP1.1 | F2.1 8.98,49.08 7.4,47.5 6.46,47.5 6.44,47.48 J1.1
  Top 0.508: F2.1 9.09,51.08 9.51,51.5 v10.01,51.5 | v24.01,52.5 23.98,52.47 22.93,52.47
  Bottom 0.508: v10.01,51.5 12.01,51.5 12.51,51 22.51,51 v24.01,52.5
VSYS  (via drill 0.35)
  Top 0.305: C5.1 20.46,54.8 U$2.P1
  Top 0.508: JP1.2 C5.1 | v44.51,61 R4.2 | C18.1 38.46,54.8 U$22.P1 | U$5.P1 67.46,53.8 C19.1 | U$3.P1 84.96,54.3 C20.1 85.01,52.95 v85.01,46.5
  Bottom 0.508: U$2.P1 20.26,58.25 22.01,60 38.01,60 | 38.01,60 38.26,59.75 U$22.P1 | 38.01,60 43.51,60 v44.51,61 63.51,61 66.26,58.25 66.26,58 | U$5.P1 66.26,58 | 66.26,58 69.26,61 82.01,61 84.26,58.75 U$3.P1 | U$6.P1 84.14,32.88 84.14,45.62 v85.01,46.5

### Text on the board
_tsilk: BACKBONE A | BACKBONE B | BACKBONE C | BACKBONE D | Slave | D10 | SDA | SCL | 3.3V | GND | VSYS | Power | D11 | SDA | SCL | 3.3V | GND | VSYS | D4 | SDA | SCL | 3.3V | GND | VSYS | SDA | SCL | 3.3V | GND | VSYS | HB | Health | 5V | RX | Service / Only | TX | 3.3V | UART | GND | 5V | PORT E: | RESET: | VSYS | GND | Raspberry Pi Zero W(2) Connector | 3.3V | SCL | 3.3V / Pi | SDA | D18 | RobotPatient.com | Designed for ManikinOS
_bsilk: BACKBONE A | BACKBONE B | BACKBONE C | BACKBONE D | UART | RobotPatient.com